# EAGLE design integrated_adc (EAGLE 9.6.2)

## Sheet 1 of 4: MCU + Periphery Ethernet Implementation Power, clock, bypassing, etc. for MCU, as well as CAN bus.
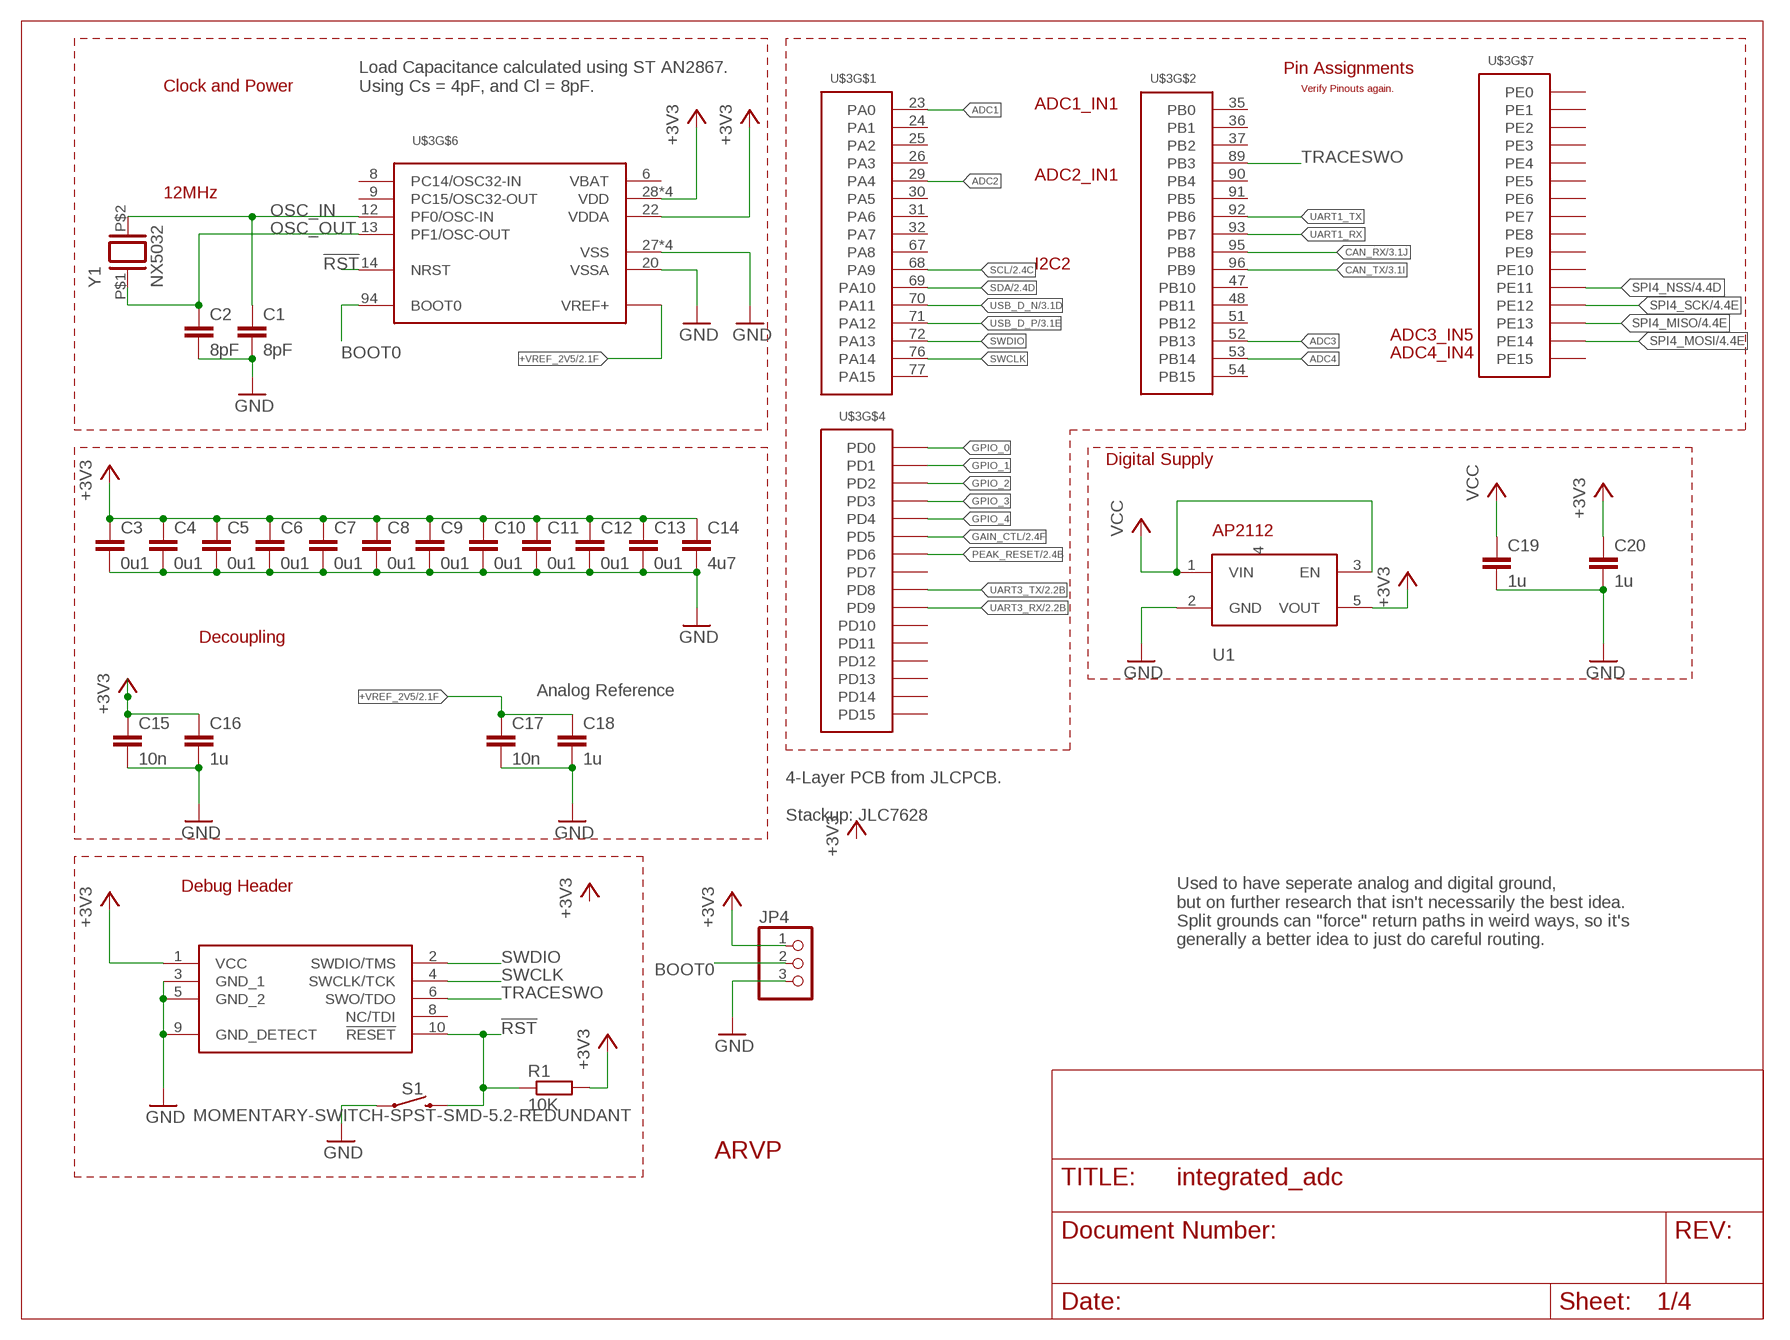
[diagram p0: schematic, sheet 1]

### Parts
ARVP1  ARVP_LOGO  [ARVP]
C1  8pF  C-EUC0805  [C0805]
C2  8pF  C-EUC0805  [C0805]
C3  0u1  C-EUC0805  [C0805]
C4  0u1  C-EUC0805  [C0805]
C5  0u1  C-EUC0805  [C0805]
C6  0u1  C-EUC0805  [C0805]
C7  0u1  C-EUC0805  [C0805]
C8  0u1  C-EUC0805  [C0805]
C9  0u1  C-EUC0805  [C0805]
C10  0u1  C-EUC0805  [C0805]
C11  0u1  C-EUC0805  [C0805]
C12  0u1  C-EUC0805  [C0805]
C13  0u1  C-EUC0805  [C0805]
C14  4u7  C-EUC0805  [C0805]
C15  10n  C-EUC0805  [C0805]
C16  1u  C-EUC0805  [C0805]
C17  10n  C-EUC0805  [C0805]
C18  1u  C-EUC0805  [C0805]
C19  1u  C-EUC0805  [C0805]
C20  1u  C-EUC0805  [C0805]
JP1  CORTEX-M-DBG  [FTSH-105-01-F-DV-007]
JP4  PINHD-1X3  [1X03]
R1  10K  R-EU_R0805  [R0805]
S1  MOMENTARY-SWITCH-SPST-SMD-5.2-REDUNDANT  [TACTILE_SWITCH_SMD_5.2MM]
U1  AP2112K-3.3TRG1  [SOT25]
U$3  STM32F303VE  [LQFP100]
Y1  NX5032  [NX5032]

### Nets
!RST: JP1.10(!RESET) R1.1 S1.3 S1.4 U$3.14(NRST)
+3V3: C3.1 C4.1 C5.1 C6.1 C7.1 C8.1 C9.1 C10.1 C11.1 C12.1 C13.1 C14.1 C15.1 C16.1 C20.1 JP1.1(VCC) JP4.1 R1.2 U1.5(VOUT) U$3.22(VDDA) U$3.28(VDD) U$3.50(VDD) U$3.75(VDD) U$3.100(VDD) ; also sheet 2,3,4
+VREF_2V5: C17.1 C18.1 U$3.21(VREF+) ; also sheet 2
ADC1: U$3.23(PA0) ; also sheet 2
ADC2: U$3.29(PA4) ; also sheet 2
ADC3: U$3.52(PB13) ; also sheet 2
ADC4: U$3.53(PB14) ; also sheet 2
BOOT0: JP4.2 U$3.94(BOOT0)
CAN_RX: U$3.95(PB8) ; also sheet 3
CAN_TX: U$3.96(PB9) ; also sheet 3
GAIN_CTL: U$3.86(PD5) ; also sheet 2
GND: C1.2 C2.2 C3.2 C4.2 C5.2 C6.2 C7.2 C8.2 C9.2 C10.2 C11.2 C12.2 C13.2 C14.2 C15.2 C16.2 C17.2 C18.2 C19.2 C20.2 JP1.3(GND_1) JP1.5(GND_2) JP1.9(GND_DETECT) JP4.3 S1.1 S1.2 U1.2(GND) U$3.20(VSSA) U$3.27(VSS) U$3.49(VSS) U$3.74(VSS) U$3.99(VSS) ; also sheet 2,3,4
GPIO_0: U$3.81(PD0) ; also sheet 2
GPIO_1: U$3.82(PD1) ; also sheet 2
GPIO_2: U$3.83(PD2) ; also sheet 2
GPIO_3: U$3.84(PD3) ; also sheet 2
GPIO_4: U$3.85(PD4) ; also sheet 2
OSC_IN: C1.1 U$3.12(PF0/OSC-IN) Y1.P$2
OSC_OUT: C2.1 U$3.13(PF1/OSC-OUT) Y1.P$1
PEAK_RESET: U$3.87(PD6) ; also sheet 2
SCL: U$3.68(PA9) ; also sheet 2,3
SDA: U$3.69(PA10) ; also sheet 2,3
SPI4_MISO: U$3.44(PE13) ; also sheet 4
SPI4_MOSI: U$3.45(PE14) ; also sheet 4
SPI4_NSS: U$3.42(PE11) ; also sheet 4
SPI4_SCK: U$3.43(PE12) ; also sheet 4
SWCLK: JP1.4(SWCLK/TCK) U$3.76(PA14)
SWDIO: JP1.2(SWDIO/TMS) U$3.72(PA13)
TRACESWO: JP1.6(SWO/TDO) U$3.89(PB3)
UART1_RX: U$3.93(PB7)
UART1_TX: U$3.92(PB6)
UART3_RX: U$3.56(PD9) ; also sheet 2
UART3_TX: U$3.55(PD8) ; also sheet 2
USB_D_N: U$3.70(PA11) ; also sheet 3
USB_D_P: U$3.71(PA12) ; also sheet 3
VCC: C19.1 U1.1(VIN) U1.3(EN) ; also sheet 2,3
Unconnected: JP1.8(NC/TDI) U1.4(NC) U$3.1(PE2) U$3.2(PE3) U$3.3(PE4) U$3.4(PE5) U$3.5(PE6) U$3.6(VBAT) U$3.7(PC13) U$3.8(PC14/OSC32-IN) U$3.9(PC15/OSC32-OUT) U$3.10(PF9) U$3.11(PF10) U$3.15(PC0) U$3.16(PC1) U$3.17(PC2) U$3.18(PC3) U$3.19(PF2) U$3.24(PA1) U$3.25(PA2) U$3.26(PA3) U$3.30(PA5) U$3.31(PA6) U$3.32(PA7) U$3.33(PC4) U$3.34(PC5) U$3.35(PB0) U$3.36(PB1) U$3.37(PB2) U$3.38(PE7) U$3.39(PE8) U$3.40(PE9) U$3.41(PE10) U$3.46(PE15) U$3.47(PB10) U$3.48(PB11) U$3.51(PB12) U$3.54(PB15) U$3.57(PD10) U$3.58(PD11) U$3.59(PD12) U$3.60(PD13) U$3.61(PD14) U$3.62(PD15) U$3.63(PC6) U$3.64(PC7) U$3.65(PC8) U$3.66(PC9) U$3.67(PA8) U$3.73(PF6) U$3.77(PA15) U$3.78(PC10) U$3.79(PC11) U$3.80(PC12) U$3.88(PD7) U$3.90(PB4) U$3.91(PB5) U$3.97(PE0) U$3.98(PE1)

### Notes on the sheet
- Pin Assignments
- Clock and Power
- Load Capacitance calculated using ST AN2867.
  Using Cs = 4pF, and Cl = 8pF.
- Verify Pinouts again.
- ADC1_IN1
- ADC2_IN1
- 12MHz
- I2C2
- ADC3_IN5
- ADC4_IN4
- Digital Supply
- Decoupling
- Analog Reference
- 4-Layer PCB from JLCPCB.
  
  Stackup: JLC7628
- Debug Header
- Used to have seperate analog and digital ground,
  but on further research that isn't necessarily the best idea.
  Split grounds can "force" return paths in weird ways, so it's
  generally a better idea to just do careful routing.

## Sheet 2 of 4: Analog Measurement + Inputs Has the external ADC, as well as all the connections required for reading the hydrophone signals.
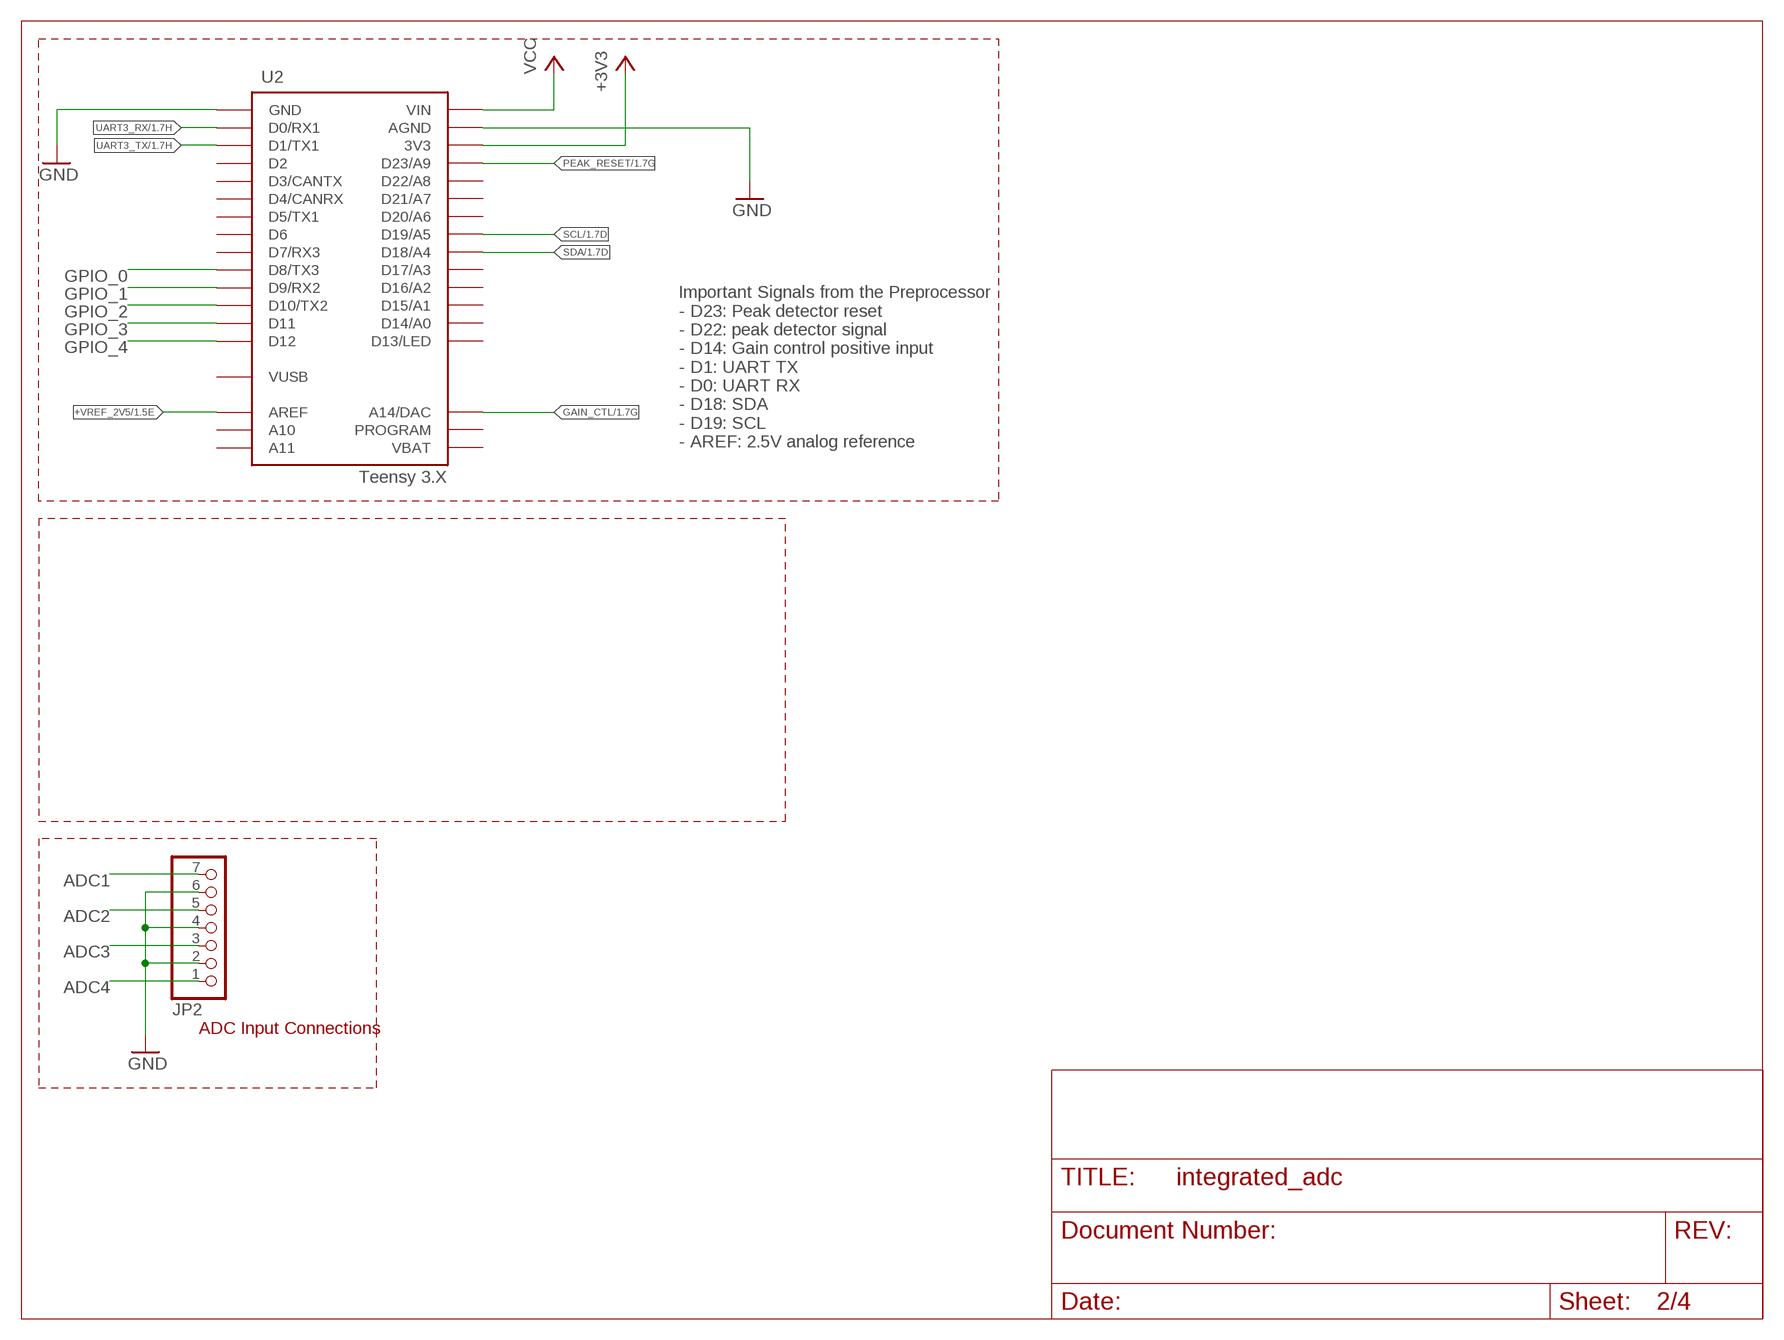
[diagram p1: schematic, sheet 2]

### Parts
JP2  PINHD-1X7/90  [1X07/90]
U2  TEENSY_3.X_PINOUT  [TEENSY_3.X_PINOUT]

### Nets
+3V3: U2.3V3 U2.3V3_2(3V3) ; also sheet 1,3,4
+VREF_2V5: U2.AREF ; also sheet 1
ADC1: JP2.7 ; also sheet 1
ADC2: JP2.5 ; also sheet 1
ADC3: JP2.3 ; also sheet 1
ADC4: JP2.1 ; also sheet 1
GAIN_CTL: U2.A14(A14/DAC) ; also sheet 1
GND: JP2.2 JP2.4 JP2.6 U2.AGND U2.GND_1(GND) U2.GND_2(GND) ; also sheet 1,3,4
GPIO_0: U2.D8(D8/TX3) ; also sheet 1
GPIO_1: U2.D9(D9/RX2) ; also sheet 1
GPIO_2: U2.D10(D10/TX2) ; also sheet 1
GPIO_3: U2.D11 ; also sheet 1
GPIO_4: U2.D12 ; also sheet 1
PEAK_RESET: U2.D23(D23/A9) ; also sheet 1
SCL: U2.D19(D19/A5) ; also sheet 1,3
SDA: U2.D18(D18/A4) ; also sheet 1,3
UART3_RX: U2.D0(D0/RX1) ; also sheet 1
UART3_TX: U2.D1(D1/TX1) ; also sheet 1
VCC: U2.VIN ; also sheet 1,3
Unconnected: U2.A10 U2.A11 U2.D2 U2.D3(D3/CANTX) U2.D4(D4/CANRX) U2.D5(D5/TX1) U2.D6 U2.D7(D7/RX3) U2.D13(D13/LED) U2.D14(D14/A0) U2.D15(D15/A1) U2.D16(D16/A2) U2.D17(D17/A3) U2.D20(D20/A6) U2.D21(D21/A7) U2.D22(D22/A8) U2.PROGRAM U2.VBAT

### Notes on the sheet
- Important Signals from the Preprocessor
  - D23: Peak detector reset
  - D22: peak detector signal
  - D14: Gain control positive input
  - D1: UART TX
  - D0: UART RX
  - D18: SDA
  - D19: SCL
  - AREF: 2.5V analog reference
- ADC Input Connections

## Sheet 3 of 4: Communications
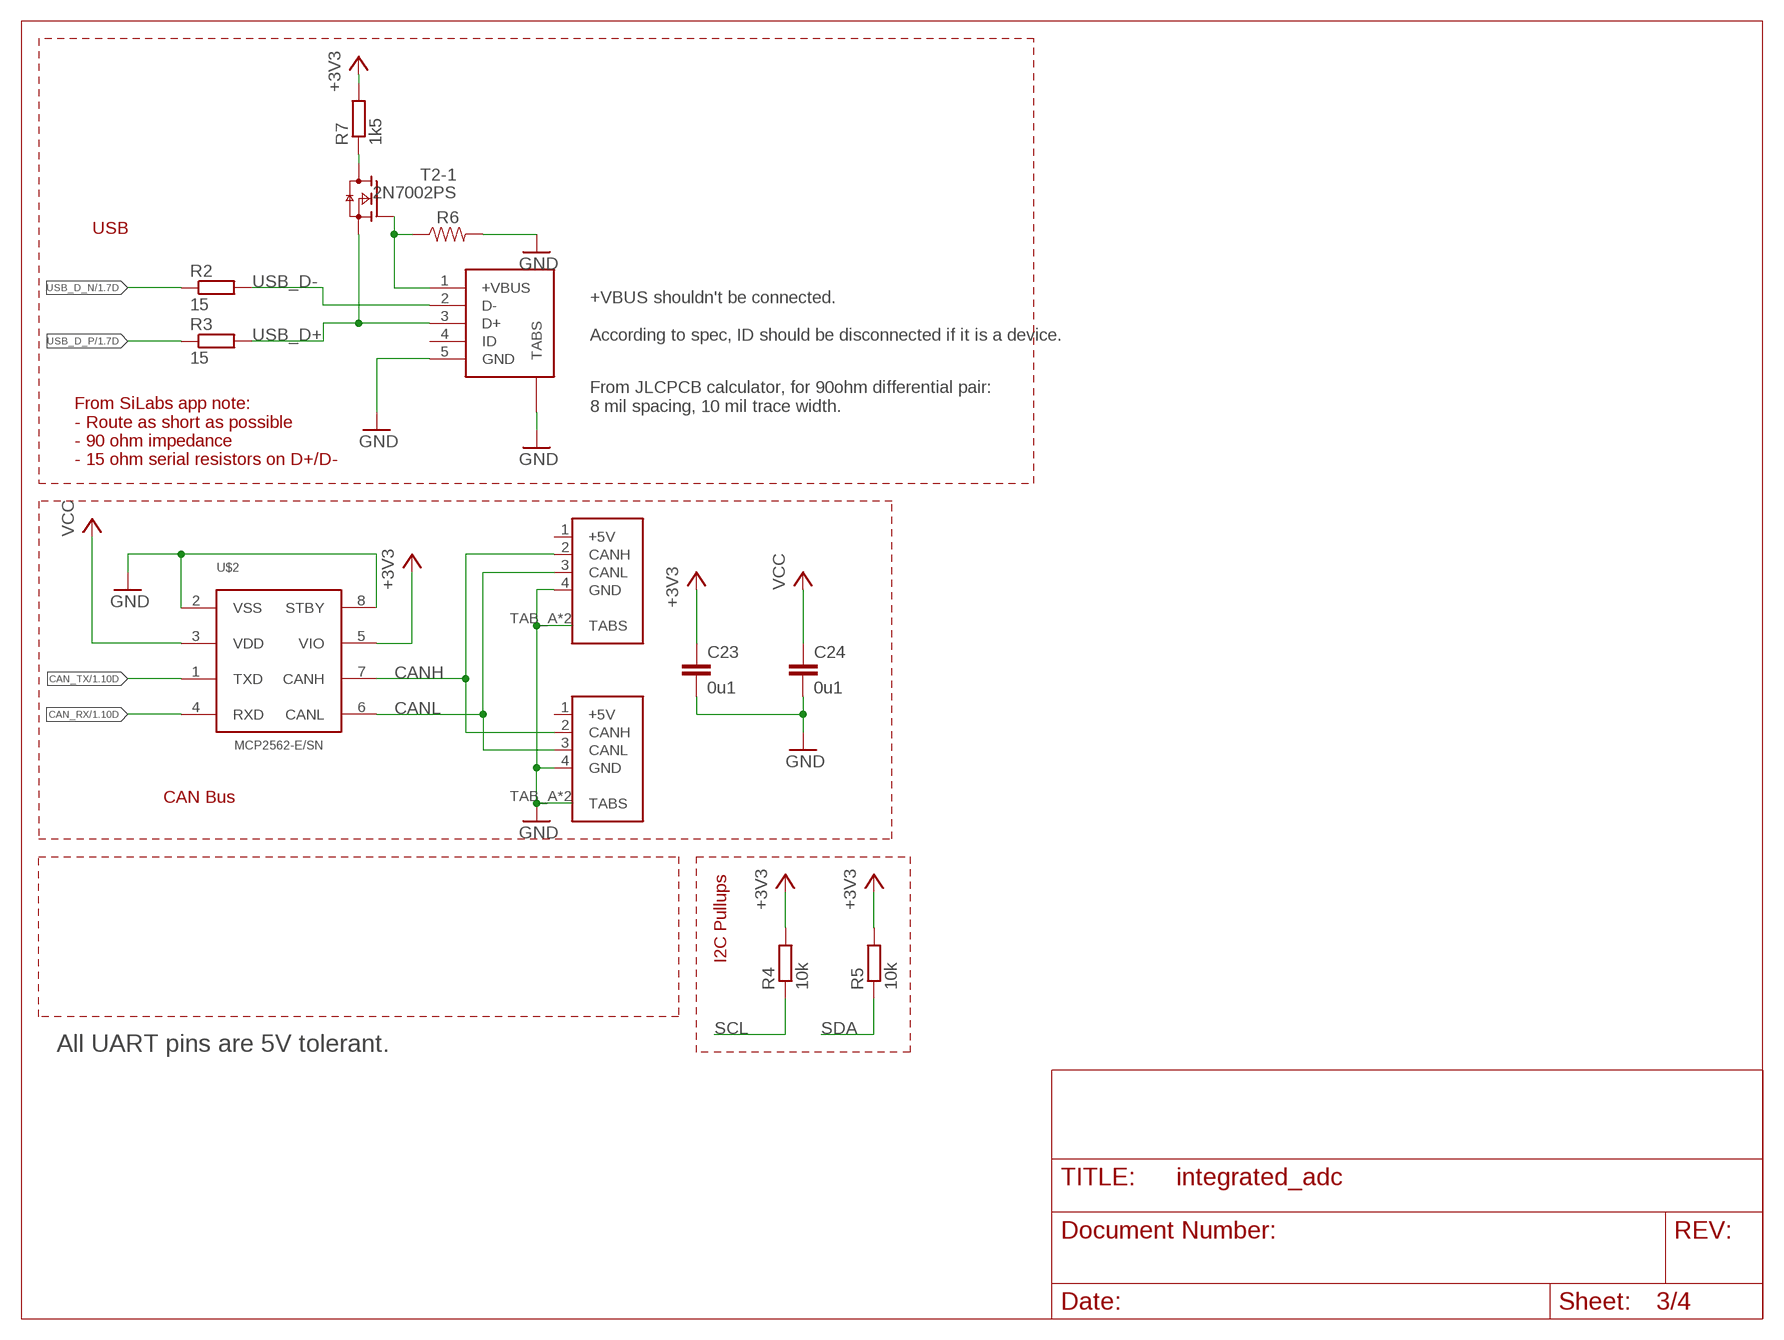
[diagram p2: schematic, sheet 3]

### Parts
C23  0u1  C-EUC0805  [C0805]
C24  0u1  C-EUC0805  [C0805]
CON1  UAVCAN_MICRO  [SM04B-GHS-TB]
CON2  UAVCAN_MICRO  [SM04B-GHS-TB]
R2  15  R-EU_R0805  [R0805]
R3  15  R-EU_R0805  [R0805]
R4  10k  R-EU_R0805  [R0805]
R5  10k  R-EU_R0805  [R0805]
R6  RESISTOR1206  [1206]
R7  1k5  R-EU_R0805  [R0805]
T2  2N7002PS  [SOT363]
U$2  MCP2562-E/SN  [SOIC8]
U$4  AMPHENOL_MICROB-USB  [AMPHENOL_MICROB_SMD]

### Nets
+3V3: C23.1 R4.2 R5.2 R7.2 U$2.5(VIO) ; also sheet 1,2,4
CAN_RX: U$2.4(RXD) ; also sheet 1
CAN_TX: U$2.1(TXD) ; also sheet 1
CANH: CON1.2(CANH) CON2.2(CANH) U$2.7(CANH)
CANL: CON1.3(CANL) CON2.3(CANL) U$2.6(CANL)
GND: C23.2 C24.2 CON1.4(GND) CON1.TAB_A(TABS) CON1.TAB_B(TABS) CON2.4(GND) CON2.TAB_A(TABS) CON2.TAB_B(TABS) R6.2 U$2.2(VSS) U$2.8(STBY) U$4.5(GND) U$4.TAB1(TABS) U$4.TAB2(TABS) U$4.TAB3(TABS) U$4.TAB4(TABS) ; also sheet 1,2,4
N$1: R6.1 T2.2(-1:G) U$4.1(+VBUS)
N$4: R7.1 T2.6(-1:D)
SCL: R4.1 ; also sheet 1,2
SDA: R5.1 ; also sheet 1,2
USB_D+: R3.2 T2.1(-1:S) U$4.3(D+)
USB_D-: R2.2 U$4.2(D-)
USB_D_N: R2.1 ; also sheet 1
USB_D_P: R3.1 ; also sheet 1
VCC: C24.1 U$2.3(VDD) ; also sheet 1,2
Unconnected: CON1.1(+5V) CON2.1(+5V) T2.3(-2:D) T2.4(-2:S) T2.5(-2:G) U$4.4(ID)

### Notes on the sheet
- USB
- +VBUS shouldn't be connected.
  
  According to spec, ID should be disconnected if it is a device.
- From JLCPCB calculator, for 90ohm differential pair:
  8 mil spacing, 10 mil trace width.
- From SiLabs app note:
  - Route as short as possible
  - 90 ohm impedance
  - 15 ohm serial resistors on D+/D-
- CAN Bus
- I2C Pullups
- All UART pins are 5V tolerant.

## Sheet 4 of 4: Ethernet Implementation
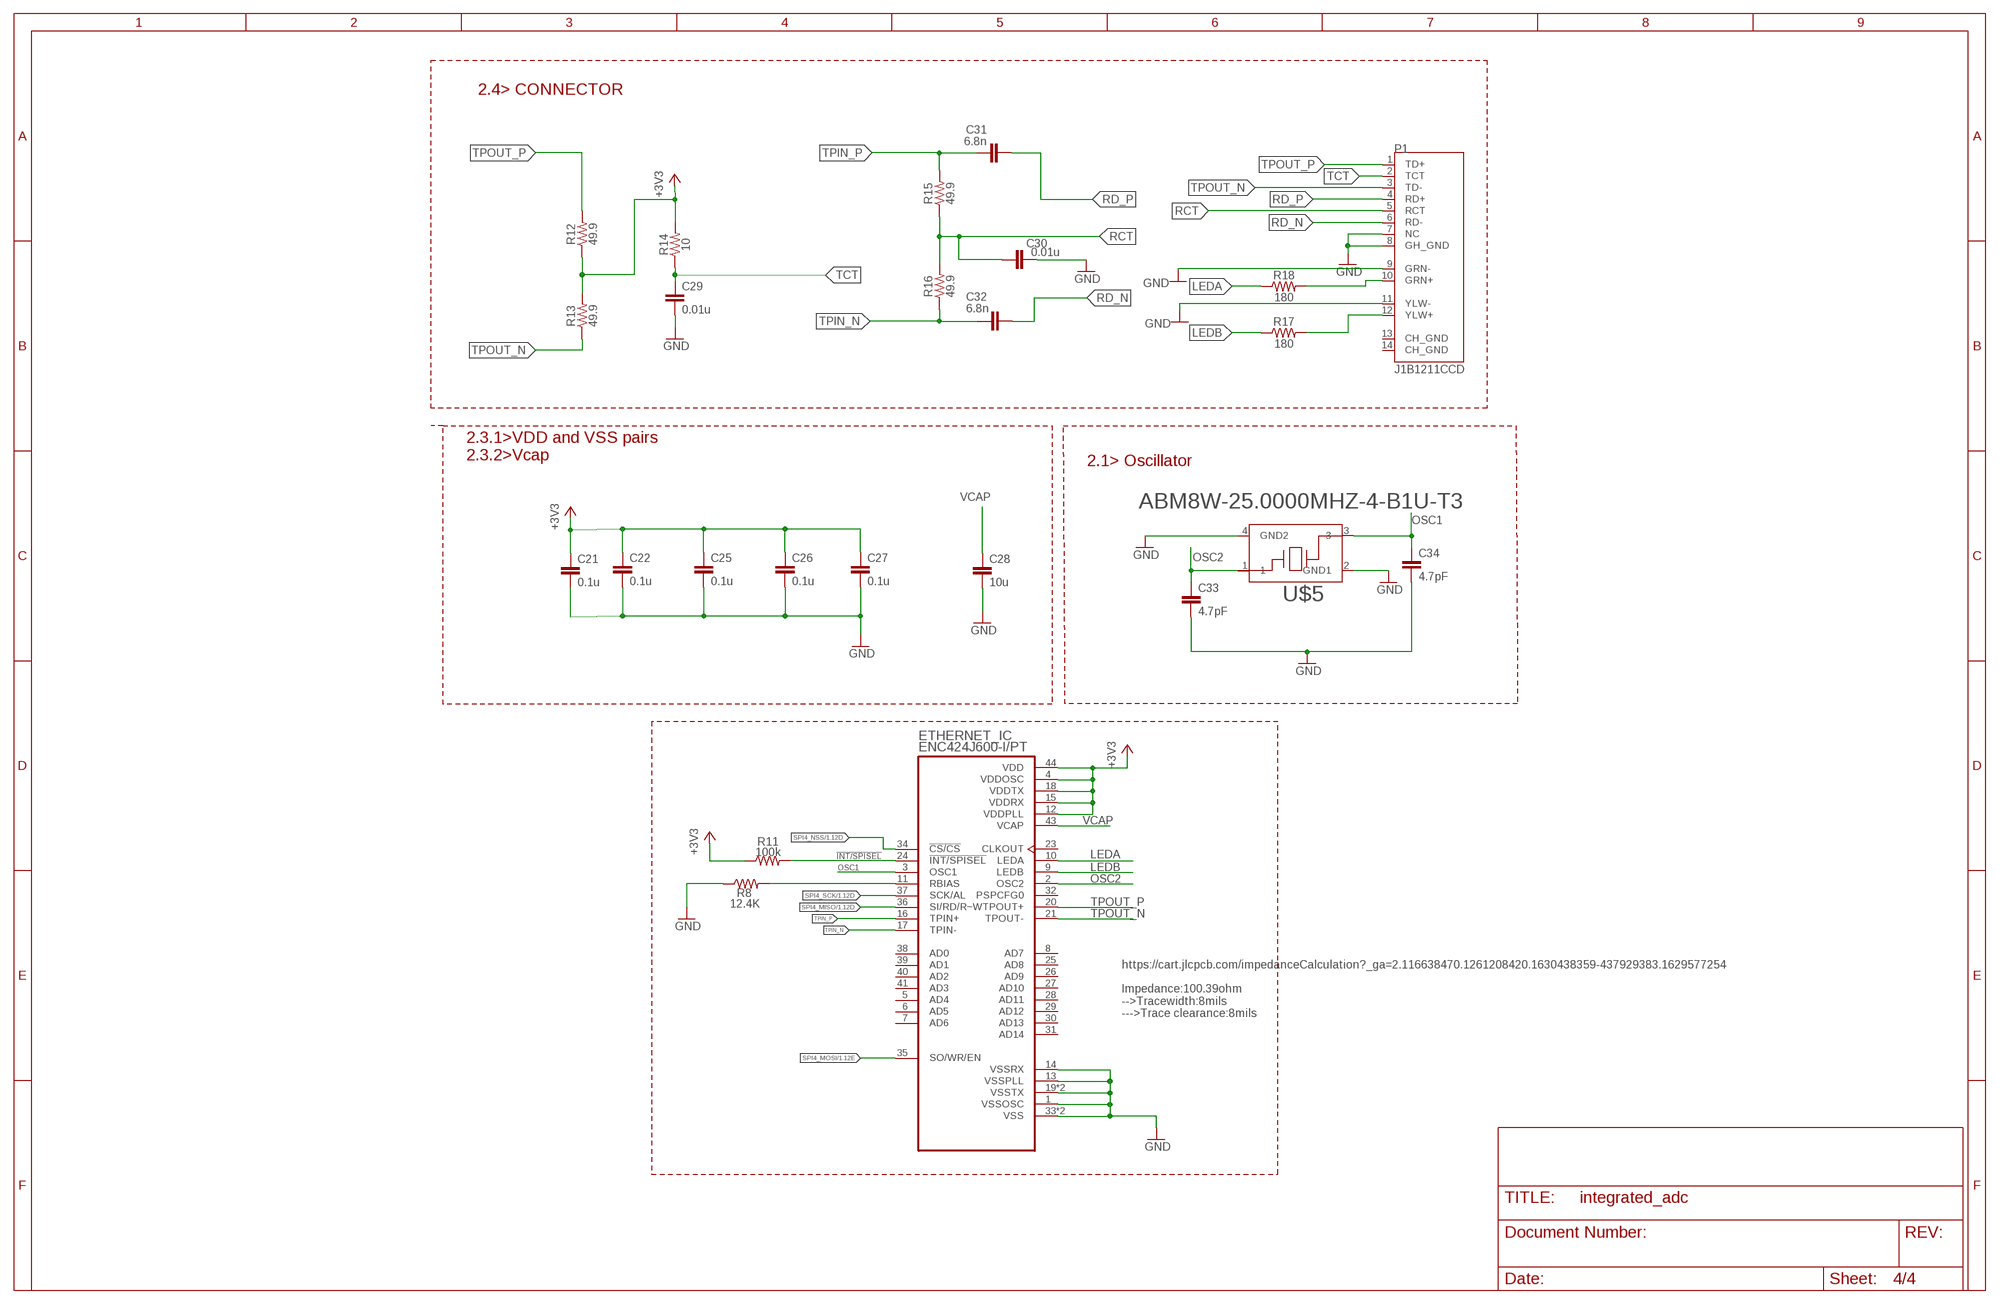
[diagram p3: schematic, sheet 4]

### Parts
C21  0.1u  C-EUC0402  [C0402]
C22  0.1u  C-EUC0402  [C0402]
C25  0.1u  C-EUC0402  [C0402]
C26  0.1u  C-EUC0402  [C0402]
C27  0.1u  C-EUC0402  [C0402]
C28  10u  C-EUC0402  [C0402]
C29  0.01u  C-EUC0402  [C0402]
C30  0.01u  C-EUC0402  [C0402]
C31  6.8n  C-EUC0402  [C0402]
C32  6.8n  C-EUC0402  [C0402]
C33  4.7pF  C-EUC0402  [C0402]
C34  4.7pF  C-EUC0402  [C0402]
ETHERNET_IC  ENC424J600-I/PT  [QFP80P1200X1200X120-44N]
P1  J1B1211CCD  [J1B1211CCD]
R8  12.4K  1.8MOHM  [0603]
R11  100k  100KOHM-0603-1/10W-1%  [0603]
R12  49.9  715OHM-0603-1/10W-1%  [0603]
R13  49.9  715OHM-0603-1/10W-1%  [0603]
R14  10  715OHM-0603-1/10W-1%  [0603]
R15  49.9  715OHM-0603-1/10W-1%  [0603]
R16  49.9  715OHM-0603-1/10W-1%  [0603]
R17  180  AC0603FR-0712K4L  [RESC1608X55N]
R18  180  AC0603FR-0712K4L  [RESC1608X55N]
U$5  ABM8W-25.0000MHZ-4-B1U-T3  [XTAL_ABM8W-25.0000MHZ-4-B1U-T3]

### Nets
!INT/SPISEL!: ETHERNET_IC.24(!INT/SPISEL) R11.2
+3V3: C21.1 C22.1 C25.1 C26.1 C27.1 ETHERNET_IC.4(VDDOSC) ETHERNET_IC.12(VDDPLL) ETHERNET_IC.15(VDDRX) ETHERNET_IC.18(VDDTX) ETHERNET_IC.44(VDD) R11.1 R12.1 R13.2 R14.2 ; also sheet 1,2,3
GND: C21.2 C22.2 C25.2 C26.2 C27.2 C28.2 C29.2 C30.2 C33.2 C34.2 ETHERNET_IC.1(VSSOSC) ETHERNET_IC.13(VSSPLL) ETHERNET_IC.14(VSSRX) ETHERNET_IC.19(VSSTX) ETHERNET_IC.22(VSSTX) ETHERNET_IC.33(VSS) ETHERNET_IC.42(VSS) P1.7(NC) P1.8(GH_GND) P1.9(GRN-) P1.11(YLW-) R8.1 U$5.2(GND1) U$5.4(GND2) ; also sheet 1,2,3
LEDA: ETHERNET_IC.10(LEDA) R18.1
LEDB: ETHERNET_IC.9(LEDB) R17.1
N$2: P1.10(GRN+) R18.2
N$3: P1.12(YLW+) R17.2
OSC1: C34.1 ETHERNET_IC.3(OSC1) U$5.3
OSC2: C33.1 ETHERNET_IC.2(OSC2) U$5.1
RBIAS: ETHERNET_IC.11(RBIAS) R8.2
RCT: C30.1 P1.5(RCT) R15.1 R16.2
RD_N: C32.1 P1.6(RD-)
RD_P: C31.2 P1.4(RD+)
SPI4_MISO: ETHERNET_IC.36(SI/RD/R~W) ; also sheet 1
SPI4_MOSI: ETHERNET_IC.35(SO/WR/EN) ; also sheet 1
SPI4_NSS: ETHERNET_IC.34(!CS/CS) ; also sheet 1
SPI4_SCK: ETHERNET_IC.37(SCK/AL) ; also sheet 1
TCT: C29.1 P1.2(TCT) R14.1
TPIN_N [ethernet_ic_diff]: C32.2 ETHERNET_IC.17(TPIN-) R16.1
TPIN_P [ethernet_ic_diff]: C31.1 ETHERNET_IC.16(TPIN+) R15.2
TPOUT_N [ethernet_ic_diff]: ETHERNET_IC.21(TPOUT-) P1.3(TD-) R13.1
TPOUT_P [ethernet_ic_diff]: ETHERNET_IC.20(TPOUT+) P1.1(TD+) R12.2
VCAP: C28.1 ETHERNET_IC.43(VCAP)
Unconnected: ETHERNET_IC.5(AD4) ETHERNET_IC.6(AD5) ETHERNET_IC.7(AD6) ETHERNET_IC.8(AD7) ETHERNET_IC.23(CLKOUT) ETHERNET_IC.25(AD8) ETHERNET_IC.26(AD9) ETHERNET_IC.27(AD10) ETHERNET_IC.28(AD11) ETHERNET_IC.29(AD12) ETHERNET_IC.30(AD13) ETHERNET_IC.31(AD14) ETHERNET_IC.32(PSPCFG0) ETHERNET_IC.38(AD0) ETHERNET_IC.39(AD1) ETHERNET_IC.40(AD2) ETHERNET_IC.41(AD3) P1.13(CH_GND) P1.14(CH_GND)

### Notes on the sheet
- 2.4> CONNECTOR
- 2.3.1>VDD and VSS pairs
  2.3.2>Vcap
- 2.1> Oscillator
- https://cart.jlcpcb.com/impedanceCalculation?_ga=2.116638470.1261208420.1630438359-437929383.1629577254
  
  Impedance:100.39ohm
  -->Tracewidth:8mils
  --->Trace clearance:8mils

## Power pins joined to a net without a drawn wire
VUSB: U2.VUSB

## Library data of the parts
ARVP1 = ARVP:ARVP_LOGO
C1-C20 C23 C24 = resistor:C-EU: CAPACITOR, European symbol
C21 C22 C25-C32 = ENC424J600_ethernet_circuits (1):C-EU: CAPACITOR, European symbol; SPICEPREFIX: C
C33 C34 = rcl:C-EU: CAPACITOR, European symbol; SPICEPREFIX: C
CON1 CON2 = integrated_adc:UAVCAN_MICRO: CAN Bus Standard Connector
ETHERNET_IC = ENC424J600_ethernet_circuits (1):ENC424J600-I/PT: IC ETHERNET CTRLR W/SPI 44-TQFP// Ethernet Controller 10/100 Base-T PHY SPI, Parallel Interface 44-TQFP (10x10)// Datasheet link: http://ww1.microchip.com/downloads/en/DeviceDoc/39935c.pdf; AVAILABILITY: In Stock; DESCRIPTION: Ethernet Controller 10/100 Base-T PHY SPI, Parallel Interface 44-TQFP (10x10); MF: Microchip; MP: ENC424J600-I/PT; PACKAGE: TQFP-44 Microchip; PRICE: None
JP1 = integrated_adc:CORTEX-M-DBG: Cortex-M Debug Header Standard debug/programming header used for programming Cortex parts. Does not include shroud but does have key pin removed.
JP2 = pinhead:PINHD-1X7: PIN HEADER
JP4 = pinhead:PINHD-1X3: PIN HEADER
P1 = J1B1211CCD:J1B1211CCD: J1B1211CCD SINGLE RJ45 CONNECTOR MODULE WITH 10/100 BASE-TX MAGNETICS AND LEDS. -Suitable for CAT 5 & 6 Fast Ethernet Cable or better UTP. -Meets or exceeds IEEE 802.3 standard for 100 Base-T. -350 µH minimum OCL with 8 mA bias current. -Minimum 1500 Vrms isolation per IEEE 802.3 requirement. -All materials are RoHS and UL94-V0 compliant. -RoHS peak solder rating 260°C. -Meet EN60950-1 basic insulation requirement. -Recommended panel. Check prices <https://pricing.snapeda.com/parts/J1B1211CCD/Ceetus/view-part?ref=eda>; AVAILABILITY: In Stock; DESCRIPTION: 1 Port RJ45 Magjack Connector Through Hole 10/100 Base-T, AutoMDIX; MF: Ceetus; MP: J1B1211CCD; PACKAGE: None; PRICE: None; PURCHASE-URL: https://pricing.snapeda.com/search/part/J1B1211CCD/?ref=eda
R1-R5 R7 = resistor:R-EU_: RESISTOR, European symbol
R6 = SparkFun-Resistors:RESISTOR: Generic Resistor Package
R8 = SparkFun-Resistors:1.8MOHM: 1.8 MOhms ±5% 0.1W, 1/10W Chip Resistor 0603; PROD_ID: RES-13994; VALUE: 1.8M
R11 = ENC424J600_ethernet_circuits (1):100KOHM: 100kΩ resistor A resistor is a passive two-terminal electrical component that implements electrical resistance as a circuit element. Resistors act to reduce current flow, and, at the same time, act to lower voltage levels within circuits. - Wikipedia; PROD_ID: RES-07828
R12-R16 = SparkFun-Resistors:715OHM: 715Ω resistor A resistor is a passive two-terminal electrical component that implements electrical resistance as a circuit element. Resistors act to reduce current flow, and, at the same time, act to lower voltage levels within circuits. - Wikipedia; PROD_ID: RES-07850; VALUE: 715
R17 R18 = ENC424J600_ethernet_circuits (1):AC0603FR-0712K4L: RES SMD 12.4K OHM 1% 1/10W 0603; DESCRIPTION: 12.4 kOhms ±1% 0.1W, 1/10W Chip Resistor 0603 (1608 Metric) Automotive AEC-Q200, Moisture Resistant Thick Film; DIGI-KEY_PART_NUMBER: 13-AC0603FR-0712K4LCT-ND; MF: Yageo; MP: AC0603FR-0712K4L; PACKAGE: 1608 Yageo
S1 = SparkFun-Switches:MOMENTARY-SWITCH-SPST: Momentary Switch (Pushbutton) - SPST Normally-open (NO) SPST momentary switches (buttons, pushbuttons). Variants PTH-12MM - 12mm square, through-hole Momentary Pushbutton Switch - 12mm Square <https://www.sparkfun.com/products/9190> (COM-09190) PTH-6.0MM, PTH-6.0MM-KIT - 6.0mm square, through-hole Mini Pushbutton Switch <https://www.sparkfun.com/products/97> (COM-00097) KIT package intended for soldering kit's - only one side of pads' copper is exposed. PTH-RIGHT-ANGLE-KIT - Right-angle, through-hole Right Angle Tactile Button <https://www.sparkfun.com/products/10791> - Used on SparkFun BigTime Watch Kit <https://www.sparkfun.com/products/11734> SMD-12MM - 12mm square, surface-mount Tactile Button - SMD (12mm) <https://www.sparkfun.com/products/12993> (COM-12993) Used on SparkFun PicoBoard <https://www.sparkfun.com/products/11888> SMD-4.5MM - 4.5mm Square Trackball Switch Used on SparkFun Blackberry Trackballer Breakout <https://www.sparkfun.com/products/13169> SMD-4.6MMX2.8MM - 4.60mm x 2.80mm, surface mount Used on SparkFun SAMD21 Mini Breakout <https://www.sparkfun.com/products/13664> SMD-5.2MM, SMD-5.2-REDUNDANT - 5.2mm square, surface-mount Mini Pushbutton Switch - SMD <https://www.sparkfun.com/products/8720> (COM-08720) Used on Arduino Pro Mini <https://www.sparkfun.com/products/11114> REDUNDANT package connects both switch circuits together SMD-6.0X3.5MM - 6.0 x 3.5mm, surface mount Momentary Reset Switch SMD <https://www.sparkfun.com/products/8229> (COM-08229) SMD-6.2MM-TALL - 6.2mm square, surface mount Tactile Button - SMD (6mm) <https://www.sparkfun.com/products/12992> Used on SparkFun Digital Sandbox <https://www.sparkfun.com/products/12651> SMD-RIGHT-ANGLE - Right-angle, surface mount Used on SparkFun Block for Intel® Edison - Arduino <https://www.sparkfun.com/products/13036>; PROD_ID: SWCH-08247; SF_SKU: COM-08720
T2 = nxp_60:2N7002P: 60 V, 320 mA N-channel Trench MOSFET Dual N-channel enhancement mode Field-Effect Transistor (FET) in a very small SOT363 (SC-88) Surface-Mounted Device (SMD) plastic package using Trench MOSFET technology. AAL Eindhoven MK
U1 = integrated_adc:AP2112K-3.3TRG1
U2 = integrated_adc:TEENSY_3.X_PINOUT: Teensy 3.X Footprint Designed to accept a teensy 3.0, 3.1, or 3.2. It can also serve as headers/pinout to replace a teensy.
U$2 = integrated_adc:MCP2562-E/SN: CAN Bus Transciever
U$3 = integrated_adc:STM32F303VE
U$4 = integrated_adc:AMPHENOL_MICROB-USB: Micro USB Receptacle DigiKey Page <https://www.digikey.ca/product-detail/en/amphenol-icc-fci/10118194-0001LF/609-4618-1-ND/2785382>
U$5 = ENC424J600_ethernet_circuits (1):ABM8W-25.0000MHZ-4-B1U-T3: CRYSTAL 25.0000MHZ 4PF SMD
Y1 = integrated_adc:NX5032

## Net classes
1 usb_diff: width 0.254 mm
2 ethernet_ic_diff: width 0.203 mm, clearance 0.203 mm

## Board
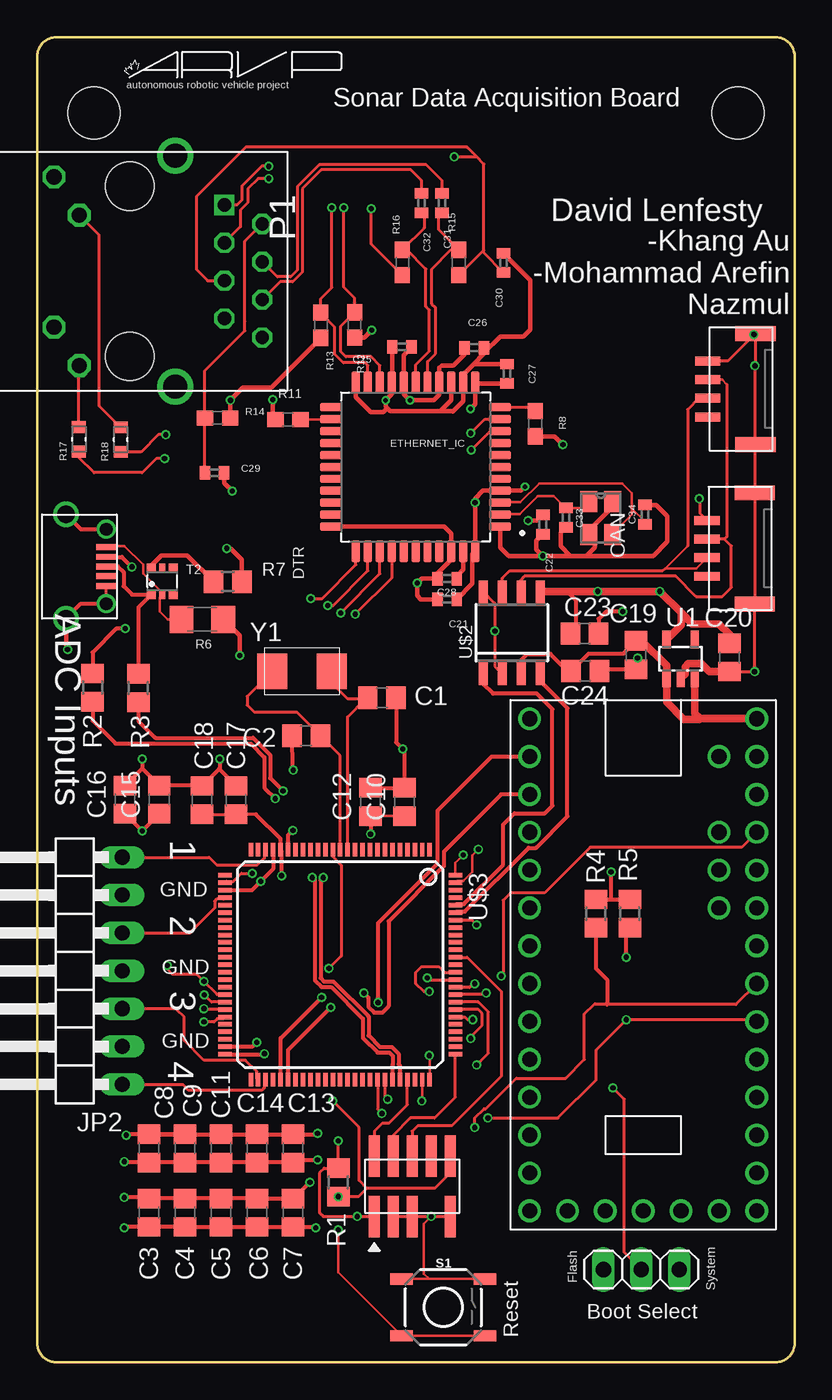
[diagram p4: board, top side]
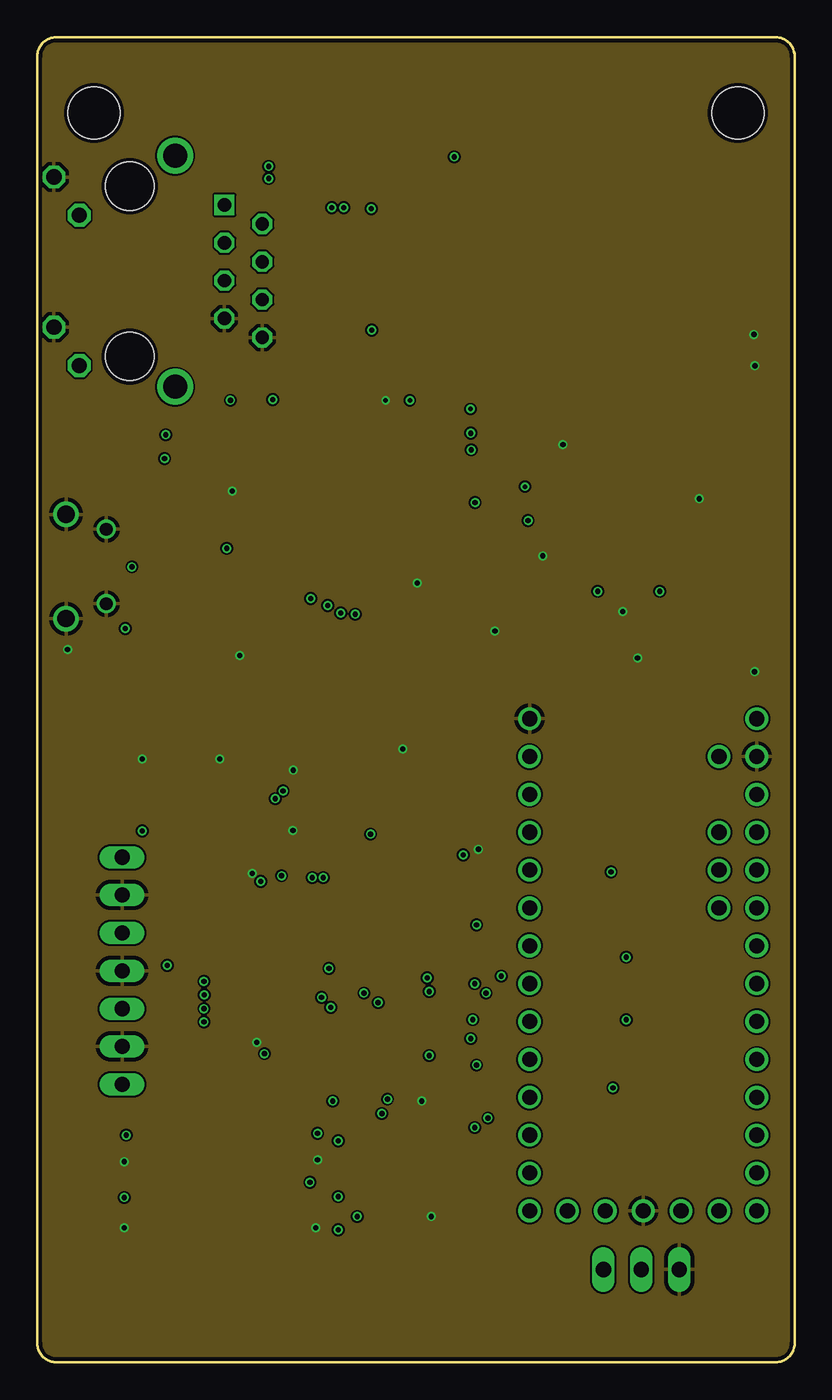
[diagram p5: board, inner layer Route2]
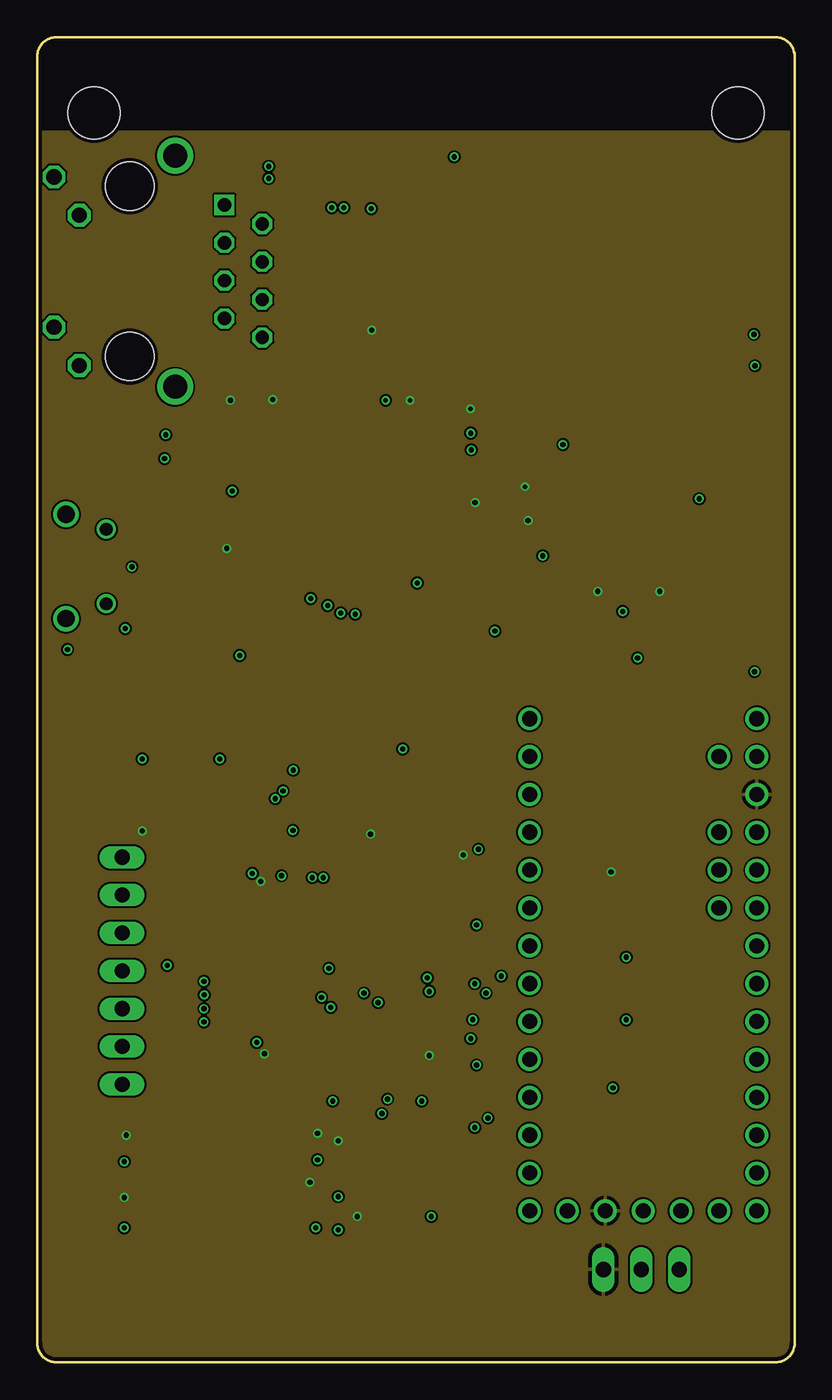
[diagram p6: board, inner layer Route15]
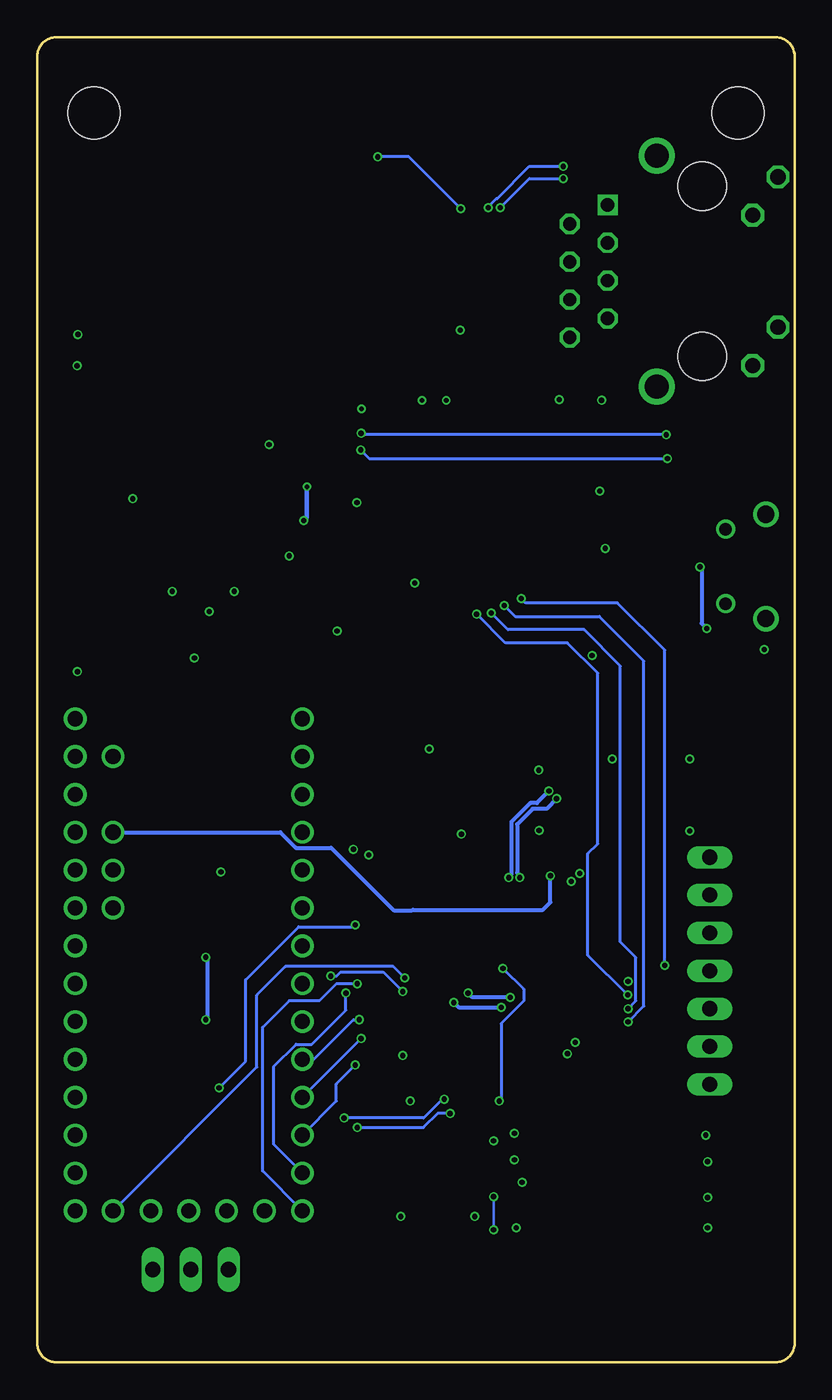
[diagram p7: board, bottom side, seen from below]

Size 50.8 x 88.9 mm. Coordinates in mm from the lower left corner, seen from the top.
Outline: 0,1.27 0,87.63 arc-90 1.27,88.9 49.53,88.9 arc-90 50.8,87.63 50.8,1.27 arc-90 49.53,0 1.27,0 arc-90 0,1.27
Copper layers (1*2*15*16): Top 0.035mm / dielectric 0.1702mm / Route2 0.0175mm / dielectric 47mil / Route15 0.0175mm / dielectric 0.1702mm / Bottom 0.035mm
Design rules "OSHPark4Layer": minimum track width 6mil, minimum drill 10mil, track to track 5mil, track to pad 5mil, pad to pad 5mil, via to via 5mil, smd to smd 0mil, copper to edge 10mil, drill to drill 10mil, minimum pad ring 5mil, minimum via ring 5mil, stop-mask expansion 2mil, vias tented up to drill 100mil, thermal gap 10mil
Holes 3.5 mm at 46.99,83.82 3.81,83.82

### Footprints (pad centres in the part's own frame; a part is rotated, then mirrored left to right if it is on the bottom)
C0805 = smd 1.3 x 1.5: 1 -0.95,0; 2 0.95,0
C0402 = smd 0.7 x 0.9: 1 -0.65,0; 2 0.65,0
SM04B-GHS-TB = smd 0.6 x 1.7: 1 -1.875,0.85; 2 -0.625,0.85; 3 0.625,0.85; 4 1.875,0.85 | smd 1 x 2.7: TAB_A -3.725,-2.35; TAB_B 3.725,-2.35
QFP80P1200X1200X120-44N = smd 1.47 x 0.55: 1 -5.67,4; 2 -5.67,3.2; 3 -5.67,2.4; 4 -5.67,1.6; 5 -5.67,0.8; 6 -5.67,0; 7 -5.67,-0.8; 8 -5.67,-1.6; 9 -5.67,-2.4; 10 -5.67,-3.2; 11 -5.67,-4; 23 5.67,-4; 24 5.67,-3.2; 25 5.67,-2.4; 26 5.67,-1.6; 27 5.67,-0.8; 28 5.67,0; 29 5.67,0.8; 30 5.67,1.6; 31 5.67,2.4; 32 5.67,3.2; 33 5.67,4 | smd 0.55 x 1.47: 12 -4,-5.67; 13 -3.2,-5.67; 14 -2.4,-5.67; 15 -1.6,-5.67; 16 -0.8,-5.67; 17 0,-5.67; 18 0.8,-5.67; 19 1.6,-5.67; 20 2.4,-5.67; 21 3.2,-5.67; 22 4,-5.67; 34 4,5.67; 35 3.2,5.67; 36 2.4,5.67; 37 1.6,5.67; 38 0.8,5.67; 39 0,5.67; 40 -0.8,5.67; 41 -1.6,5.67; 42 -2.4,5.67; 43 -3.2,5.67; 44 -4,5.67
FTSH-105-01-F-DV-007 = smd 0.737 x 2.794: 1 -2.54,-2.032; 2 -2.54,2.032; 3 -1.27,-2.032; 4 -1.27,2.032; 5 0,-2.032; 6 0,2.032; 8 1.27,2.032; 9 2.54,-2.032; 10 2.54,2.032
1X07/90 = drill 1.016 long: 1 -7.62,-3.81; 2 -5.08,-3.81; 3 -2.54,-3.81; 4 0,-3.81; 5 2.54,-3.81; 6 5.08,-3.81; 7 7.62,-3.81
1X03 = drill 1.016 long: 1 -2.54,0; 2 0,0; 3 2.54,0
J1B1211CCD = drill 0.9 square: 1 -4.445,6.35 | drill 0.9 octagon: 2 -3.175,8.89; 3 -1.905,6.35; 4 -0.635,8.89; 5 0.635,6.35; 6 1.905,8.89; 7 3.175,6.35; 8 4.445,8.89 | drill 1.02 octagon: 9 -6.325,-5.08; 10 -3.758,-3.38; 11 3.758,-5.08; 12 6.325,-3.38 | drill 1.6: 13 -7.75,3.05; 14 7.75,3.05 | hole 3.25: -5.715,0; 5.715,0
R0805 = smd 1.3 x 1.5: 1 -0.95,0; 2 0.95,0
1206 = smd 1.6 x 1.8: 1 -1.4,0; 2 1.4,0
0603 = smd 1.1 x 1: 1 -0.85,0; 2 0.85,0
RESC1608X55N = smd 0.79 x 0.93: 1 -0.82,0; 2 0.82,0
TACTILE_SWITCH_SMD_5.2MM = smd 1.524 x 0.762: 1 -2.794,1.905; 2 2.794,1.905; 3 -2.794,-1.905; 4 2.794,-1.905
SOT363 = smd 0.6 x 0.6: 1 -0.75,-0.9; 3 0.75,-0.9; 4 0.75,0.9; 6 -0.75,0.9 | smd 0.4 x 0.6: 2 0,-0.9; 5 0,0.9
SOT25 = smd 0.55 x 1.2: 1 -0.95,-1.3; 2 0,-1.3; 3 0.95,-1.3; 4 0.95,1.3; 5 -0.95,1.3
TEENSY_3.X_PINOUT = drill 1.016: 3V3 0,-5.08; 3V3_2 -10.16,-33.02; A10 -2.54,-10.16; A11 -2.54,-12.7; A14 -2.54,-33.02; AGND 0,-2.54; AREF -2.54,-7.62; D0 -15.24,-2.54; D1 -15.24,-5.08; D2 -15.24,-7.62; D3 -15.24,-10.16; D4 -15.24,-12.7; D5 -15.24,-15.24; D6 -15.24,-17.78; D7 -15.24,-20.32; D8 -15.24,-22.86; D9 -15.24,-25.4; D10 -15.24,-27.94; D11 -15.24,-30.48; D12 -15.24,-33.02; D13 0,-33.02; D14 0,-30.48; D15 0,-27.94; D16 0,-25.4; D17 0,-22.86; D18 0,-20.32; D19 0,-17.78; D20 0,-15.24; D21 0,-12.7; D22 0,-10.16; D23 0,-7.62; GND_1 -15.24,0; GND_2 -7.62,-33.02; PROGRAM -5.08,-33.02; VBAT -12.7,-33.02; VIN 0,0; VUSB -2.54,-2.54
SOIC8 = smd 0.6 x 1.5: 1 -1.905,-2.75; 2 -0.635,-2.75; 3 0.635,-2.75; 4 1.905,-2.75; 5 1.905,2.75; 6 0.635,2.75; 7 -0.635,2.75; 8 -1.905,2.75
LQFP100 = smd 0.9 x 0.3: 1 -7.72,6; 2 -7.72,5.5; 3 -7.72,5; 4 -7.72,4.5; 5 -7.72,4; 6 -7.72,3.5; 7 -7.72,3; 8 -7.72,2.5; 9 -7.72,2; 10 -7.72,1.5; 11 -7.72,1; 12 -7.72,0.5; 13 -7.72,0; 14 -7.72,-0.5; 15 -7.72,-1; 16 -7.72,-1.5; 17 -7.72,-2; 18 -7.72,-2.5; 19 -7.72,-3; 20 -7.72,-3.5; 21 -7.72,-4; 22 -7.72,-4.5; 23 -7.72,-5; 24 -7.72,-5.5; 25 -7.72,-6; 51 7.72,-6; 52 7.72,-5.5; 53 7.72,-5; 54 7.72,-4.5; 55 7.72,-4; 56 7.72,-3.5; 57 7.72,-3; 58 7.72,-2.5; 59 7.72,-2; 60 7.72,-1.5; 61 7.72,-1; 62 7.72,-0.5; 63 7.72,0; 64 7.72,0.5; 65 7.72,1; 66 7.72,1.5; 67 7.72,2; 68 7.72,2.5; 69 7.72,3; 70 7.72,3.5; 71 7.72,4; 72 7.72,4.5; 73 7.72,5; 74 7.72,5.5; 75 7.72,6 | smd 0.3 x 0.9: 26 -6,-7.72; 27 -5.5,-7.72; 28 -5,-7.72; 29 -4.5,-7.72; 30 -4,-7.72; 31 -3.5,-7.72; 32 -3,-7.72; 33 -2.5,-7.72; 34 -2,-7.72; 35 -1.5,-7.72; 36 -1,-7.72; 37 -0.5,-7.72; 38 0,-7.72; 39 0.5,-7.72; 40 1,-7.72; 41 1.5,-7.72; 42 2,-7.72; 43 2.5,-7.72; 44 3,-7.72; 45 3.5,-7.72; 46 4,-7.72; 47 4.5,-7.72; 48 5,-7.72; 49 5.5,-7.72; 50 6,-7.72; 76 6,7.72; 77 5.5,7.72; 78 5,7.72; 79 4.5,7.72; 80 4,7.72; 81 3.5,7.72; 82 3,7.72; 83 2.5,7.72; 84 2,7.72; 85 1.5,7.72; 86 1,7.72; 87 0.5,7.72; 88 0,7.72; 89 -0.5,7.72; 90 -1,7.72; 91 -1.5,7.72; 92 -2,7.72; 93 -2.5,7.72; 94 -3,7.72; 95 -3.5,7.72; 96 -4,7.72; 97 -4.5,7.72; 98 -5,7.72; 99 -5.5,7.72; 100 -6,7.72
AMPHENOL_MICROB_SMD = smd 0.4 x 1.35: 1 -1.3,2.7; 2 -0.65,2.7; 3 0,2.7; 4 0.65,2.7; 5 1.3,2.7 | drill 0.85 pad 1.25: TAB1 -2.5,2.7; TAB2 2.5,2.7 | drill 1.15 pad 1.55: TAB3 -3.5,0; TAB4 3.5,0
XTAL_ABM8W-25.0000MHZ-4-B1U-T3 = smd 1.397 x 1.143: 1 -1.1,-0.8; 2 1.1,-0.8; 3 1.1,0.8; 4 -1.1,0.8
NX5032 = smd 2 x 2.4: P$1 -2,0; P$2 2,0

### Placement (x,y rotation side)
ARVP1  5.97,85.47 0 top
C1  23.11,44.58 0 top
C2  18.03,42.04 180 top
C3  7.49,10.03 270 top
C4  9.91,10.03 270 top
C5  12.32,10.03 270 top
C6  14.73,10.03 270 top
C7  17.14,10.03 270 top
C8  7.49,14.35 270 top
C9  9.91,14.35 270 top
C10  24.64,37.59 90 top
C11  12.32,14.35 270 top
C12  22.35,37.59 90 top
C13  17.14,14.35 270 top
C14  14.73,14.35 270 top
C15  8.18,37.74 90 top
C16  5.89,37.74 90 top
C17  13.34,37.72 90 top
C18  11.05,37.72 90 top
C19  40.16,47.45 270 top
C20  46.43,47.29 270 top
C21  27.48,51.18 180 top
C22  33.91,56.21 270 top
C23  36.7,48.9 0 top
C24  36.75,46.38 0 top
C25  24.46,68.12 180 top
C26  29.31,68.07 0 top
C27  31.5,66.32 90 top
C28  27.48,52.58 180 top
C29  11.89,59.66 0 top
C30  31.27,73.76 90 top
C31  27.15,77.77 90 top
C32  25.78,77.77 270 top
C33  35.46,56.67 270 top
C34  40.77,56.87 90 top
CON1  45.82,65.3 90 top
CON2  45.77,54.61 90 top
ETHERNET_IC  25.37,60.07 180 top
JP1  25.15,11.81 0 top
JP2  1.88,26.26 90 top
JP4  40.51,6.22 0 top
P1  6.2,73.2 270 top
R1  20.19,12.06 90 top
R2  3.71,45.26 90 top
R3  6.78,45.24 90 top
R4  37.47,30.1 90 top
R5  39.75,30.1 90 top
R6  11.07,49.83 0 top
R7  12.78,52.37 0 top
R8  33.4,62.97 90 top
R11  16.81,63.25 0 top
R12  21.29,69.6 90 top
R13  19.02,69.57 270 top
R14  12.09,63.35 0 top
R15  28.27,73.79 90 top
R16  24.49,73.79 270 top
R17  2.79,61.93 90 top
R18  5.59,61.9 90 top
S1  27.23,3.68 0 top
T2  8.38,52.4 0 top
U1  43.15,47.19 0 top
U2  48.26,43.18 0 top
U$2  31.83,48.95 0 top
U$3  20.32,26.67 270 top
U$4  1.93,53.39 270 top
U$5  37.8,56.64 270 top
Y1  17.75,46.35 0 top

### Tracks (layer width: path | path; a pad name or v marks a point on that pad's centre or on a via)
!INT/SPISEL!
  Top 0.152: R11.2 19.18,63.25 19.2,63.27
  Top 0.254: 19.2,63.27 ETHERNET_IC.24
!RST  (via drill 0.35)
  Top 0.152: S1.4 S1.3 20.19,6.02 v20.19,8.89
  Top 0.203: U$3.14 19.82,33.93 20.4,33.35 20.4,27.26 v19.56,26.42 | JP1.10 27.69,12.7 26.67,11.68 22.1,11.68 | 22.1,11.68 21.53,11.12 R1.1 | 22.1,11.68 21.59,12.19 21.59,15.75 v19.81,17.53
  Bottom 0.152: v20.19,8.89 R1.1
  Bottom 0.203: v19.56,26.42 18.19,25.04 18.19,24.23 19.68,22.73 19.68,17.65 v19.81,17.53
  other vias: 20.19,11.12
+3V3  (via drill 0.3, 0.35)
  Top 0.152: U$3.75 26.32,20.54 v26.29,20.57 | U$3.100 28.04,33.5 v28.57,34.04 | C12.1 C10.1
  Top 0.203: JP1.1 v21.46,9.78 19.18,9.78 18.92,10.03 18.92,12.7 19.24,13.02 R1.2 v20.19,14.86 | 10.03,10.98 C4.1
  Top 0.254: C16.1 v7.04,35.65 C15.1 | U$3.22 15.82,33.09 v14.99,32.26 14.4,31.67 U$3.28 | U$3.50 15.21,20.67 v15.24,20.7 | 10.03,10.98 C5.1 C6.1 C7.1 17.21,10.98 v18.29,12.06 | C4.1 C3.1 7.43,11.05 v5.84,11.05 | C9.1 C11.1 C14.1 C13.1 18.73,15.3 v18.8,15.37 | C8.1 6.03,15.3 v5.97,15.24 | C12.1 v22.35,35.43 | R4.2 38.61,31.05 | 38.61,31.05 R5.2 | 38.61,31.05 38.48,31.18 v38.48,32.89 | 35.56,51.7 36.12,51.14 36.12,49.26 C23.1
  Top 0.305: C9.1 C8.1 | R7.2 13.73,53.86 12.98,54.61 v12.7,54.61 | C21.1 29.18,52.23 29.18,54.21 ETHERNET_IC.44 29.36,54.41 v29.36,57.68 29.36,57.96 29.87,58.47 ETHERNET_IC.4 32.44,58.47 v32.72,58.75 | C22.1 33.51,56.46 v32.92,56.46 | ETHERNET_IC.15 | ETHERNET_IC.15 26.98,64.92 26.59,64.54 v24.99,64.54 24.57,64.96 ETHERNET_IC.18 24.57,67.59 C25.1 | v29.06,63.96 29.38,64.27 ETHERNET_IC.12 29.45,65.67 C27.1 | ETHERNET_IC.15 26.98,66.73 27.13,66.88 27.91,66.88 28.66,67.62 C26.1 | R14.2 12.94,64.53 | 12.94,64.53 v12.95,64.54 | R13.2 15.68,65.38 13.77,65.38 12.94,64.55 12.94,64.53 | R12.1 21.93,68.75 v22.43,69.24 | R11.1 15.8,63.41 v15.8,64.59
  Top 0.508: U$2.5 35.56,51.7 37.57,51.7 v37.59,51.72 v41.75,51.72 43.18,50.29 | 43.18,50.29 43.94,49.53 45.72,49.53 46.43,48.82 C20.1 | U1.5 43.18,49.47 43.18,50.29
  Bottom 0.305: v32.92,56.46 32.72,56.67 v32.72,58.75
  pour Route15: -1.27,82.55 52.07,82.55 52.07,-1.27 -1.27,-1.27
+VREF_2V5  (via drill 0.35)
  Top 0.203: 14.67,36.77 C17.1 C18.1
  Top 0.254: v16.38,32.64 16.36,32.66 16.36,34.35 U$3.21 16.32,35.12 14.67,36.77
  Bottom 0.254: U2.AREF 34.49,35.56 33.45,34.52 31.09,34.52 26.9,30.33 25.64,30.33 25.61,30.35 16.89,30.35 16.38,30.86 v16.38,32.64
ADC1
  Top 0.203: U$3.23 15.22,34.29 15.22,33.84 14.73,33.34 12.06,33.34 11.52,33.88 JP2.7
ADC2
  Top 0.203: JP2.5 10.23,28.8 11.9,30.47 11.9,30.93 12.04,31.07 12.5,31.07 U$3.29
ADC3
  Top 0.203: U$3.52 14.72,19.05 14.72,19.5 13.96,20.27 11.17,20.27 9.84,21.59 9.84,23.18 9.3,23.72 JP2.3
ADC4
  Top 0.203: U$3.53 15.22,18.85 15.22,18.39 15.07,18.25 10.14,18.25 9.74,18.64 JP2.1
BOOT0  (via drill 0.35)
  Top 0.203: U$3.94 29.13,29.67 v29.46,29.34 | JP4.2 39.37,7.37 39.37,17.65 v38.61,18.41
  Bottom 0.203: v38.61,18.41 36.83,20.19 36.83,25.65 33.27,29.21 29.59,29.21 v29.46,29.34
CAN_RX
  Top 0.254: U$3.95 28.11,30.24 28.68,30.24 32.96,34.52 33.45,34.52 35.56,36.63 35.56,43.89 33.73,45.72 U$2.4
CAN_TX
  Top 0.254: U$3.96 28.11,30.74 28.61,30.74 31.24,33.38 31.24,36.07 32,36.83 34.04,36.83 34.54,37.34 34.54,43.81 33.5,44.86 30.58,44.86 29.92,45.52 U$2.1
CANH
  Top 0.152: 41.95,53.11 42.1,53.26 | 42.1,53.26 43.61,54.77 | 42.1,53.26 44.2,53.26 CON2.2
  Top 0.203: CON1.2 44.36,64.68 43.61,63.93 43.61,54.77 | U$2.7 31.19,52.6 31.7,53.11 41.95,53.11
CANL
  Top 0.152: CON1.3 45.93,65.93 46.25,65.61
  Top 0.203: 46.09,55.23 CON2.3 | 46.25,65.61 46.25,55.4 46.09,55.23 | 46.09,55.23 46.56,54.77 46.56,51.99 45.95,51.38 44.17,51.38 42.82,52.73 32.67,52.73 32.46,52.53 U$2.6
GAIN_CTL  (via drill 0.35)
  Top 0.203: v26.16,25.78 26.27,25.67 U$3.86
  Bottom 0.203: U2.A14 36.07,19.81 36.07,24.64 34.16,26.54 26.92,26.54 v26.16,25.78
GND  (via drill 0.3, 0.35)
  Top 0.152: U$3.74 25.82,17.57 v25.78,17.53 | v29.59,34.42 29.18,34.01 29.18,32.89 28.59,32.29 28.16,32.29 U$3.99 | S1.2 26.29,5.59 | 26.29,5.59 S1.1 | 26.29,5.59 25.93,5.94 25.93,9.3 v26.42,9.78
  Top 0.203: JP1.3 JP1.5 v26.42,9.78 JP1.9 | C8.2 7.62,13.4 9.65,13.4 C9.2 C11.2 | U$3.27 12.7,32.27 13.15,32.27 13.69,32.8 v14.42,32.8 | C19.2 40.16,47.14 v40.26,47.24 | U$4.TAB2 U$4.5 | U$2.8 30.66,50.95 30.66,50.85 30.7,50.82 v30.7,49.06 30.7,46.69 U$2.2 | v44.4,57.94 44.45,57.89 44.45,56.96 CON2.4 | C20.2 48.09,46.34 | v48.11,46.33 48.11,50.87 CON2.TAB_A CON2.TAB_B 48.12,61.53 CON1.TAB_A 48.17,66.81 | 48.17,66.81 v48.13,66.85 | CON1.4 46.32,67.18 CON1.TAB_B 48.17,66.81
  Top 0.254: C1.2 24.06,41.59 v24.51,41.15 24.64,41.02 C10.2 C12.2 | C2.2 17.09,39.8 v17.17,39.73 | v12.24,40.47 12.24,39.76 | 7.04,39.84 C15.2 11.02,38.69 C18.2 12.19,39.81 12.24,39.76 | v7.04,40.47 7.04,39.84 | 7.04,39.84 C16.2 | U$3.20 16.82,35.36 v17.14,35.69 | U$3.49 12.64,21.21 14.46,21.21 v14.72,21.47 | C17.2 12.24,39.76 | C8.2 5.9,13.4 v5.84,13.46 | v18.8,13.59 17.33,13.59 C13.2 C14.2 C11.2 9.65,13.4 | v5.84,9.02 5.91,9.08 C3.2 C4.2 C5.2 C6.2 C7.2 18.6,9.08 v18.67,9.02 | C9.2 7.62,13.4 | U$4.TAB3 2.93,55.89 U$4.TAB1 | U$4.TAB4 2.93,50.89 U$4.TAB2 | v39.27,50.37 38.15,50.37 37.65,49.87 C23.2 | C24.2 37.82,46.5 C19.2 | 48.09,46.34 v48.11,46.33
  Top 0.305: v13.59,47.42 13.57,47.44 13.57,48.74 R6.2 | 38.59,57.7 U$5.4 38.59,57.42 36.99,55.82 U$5.2 37.38,55.16 37.38,54.65 36.83,54.1 | C34.2 41.53,57.52 42.27,56.78 42.27,55.07 41.3,54.1 36.83,54.1 | U$4.TAB4 1.93,47.93 v2.03,47.83 | ETHERNET_IC.1 31.05,54.67 31.62,54.1 v33.91,54.1 | C21.2 25.73,51.18 25.48,51.44 v25.48,52.27 25.78,52.58 C28.2 26.83,52.92 27.6,53.68 27.77,53.86 ETHERNET_IC.42 27.77,55.59 27.29,56.07 ETHERNET_IC.33 | C33.2 35.1,55.66 35.1,54.76 35.76,54.1 | ETHERNET_IC.14 27.77,64.55 27.03,63.8 | 27.03,63.8 23.67,63.8 23.47,64.01 | 23.47,64.01 23.37,64.11 v23.37,64.54 23.77,64.95 ETHERNET_IC.19 23.81,65.78 C25.2 | 27.03,63.8 27.86,63.8 27.88,63.79 28.57,64.49 ETHERNET_IC.13 28.57,66.28 29.26,66.97 | ETHERNET_IC.22 21.38,64.76 22.38,63.75 23.22,63.75 23.47,64.01 | 29.26,66.97 C27.2 | C26.2 29.96,67.73 | 29.26,66.97 29.96,67.67 29.96,67.73 | C22.2 33.48,55.13 33.48,54.53 v33.91,54.1 | v33.91,54.1 35.76,54.1 | 35.76,54.1 36.83,54.1 | R8.1 34.71,62.12 v35.26,61.57 | C30.2 33.07,72.61 33.07,69.29 32.59,68.81 31.04,68.81 29.96,67.73 | C29.2 12.54,58.99 v13.08,58.45
  Top 0.508: U1.2 43.45,46.19 43.45,46.65 43.67,46.87 44.54,46.87 45.07,46.34 C20.2
  other vias: 48.07,68.96
  pour Route2: -1.27,89.81 52.07,89.81 52.07,-1.27 -1.27,-1.27
GPIO_0  (via drill 0.35)
  Top 0.203: v29.21,22.99 28.86,22.99 28.68,23.17 U$3.81
  Bottom 0.203: U2.D8 32.26,20.32 29.59,22.99 v29.21,22.99
GPIO_1  (via drill 0.35)
  Top 0.203: U$3.82 29.56,23.67 29.84,23.39 29.84,22.6 29.08,21.84 v29.08,21.72
  Bottom 0.203: U2.D9 v29.08,21.72
GPIO_2  (via drill 0.35)
  Top 0.203: v29.46,19.94 30.25,20.73 30.25,23.5 29.58,24.17 U$3.83
  Bottom 0.203: U2.D10 30.73,17.53 30.73,18.67 v29.46,19.94
GPIO_3  (via drill 0.35)
  Top 0.203: v30.1,24.77 30,24.67 U$3.84
  Bottom 0.203: U2.D11 34.92,14.61 34.92,19.85 33.44,21.34 32.38,21.34 30.1,23.62 v30.1,24.77
GPIO_4  (via drill 0.35)
  Top 0.203: U$3.85 28.07,25.14 28.98,25.14 29.24,25.4 v29.34,25.4
  Bottom 0.203: U2.D12 35.69,12.83 35.69,22.48 33.91,24.26 31.88,24.26 30.74,25.4 v29.34,25.4
LEDA  (via drill 0.35)
  Top 0.203: v29.08,62.33 30.02,63.27 ETHERNET_IC.10 | R18.1 6.96,61.08 8.11,62.23 v8.61,62.23
  Bottom 0.203: v29.08,62.33 28.98,62.23 v8.61,62.23
LEDB  (via drill 0.35)
  Top 0.203: ETHERNET_IC.9 30.36,62.47 v29.11,61.21 | v8.53,60.63 7.98,60.63 7.04,59.69 3.81,59.69 2.79,60.71 R17.1
  Bottom 0.203: v29.11,61.21 28.52,60.63 v8.53,60.63
N$1
  Top 0.152: U$4.1 4.71,54.77 5.84,54.77 7.1,53.51 7.1,52.92 8.38,51.64 T2.2 8.2,51.32 8.2,50.37 8.74,49.84 R6.1
N$2
  Top 0.203: R18.2 4.14,64.17 4.14,75.64 P1.10
N$3
  Top 0.203: R17.2 2.79,66.85 P1.12
N$4
  Top 0.152: T2.6 7.65,53.31
  Top 0.305: R7.1 10.07,54.13 8.31,54.13 7.65,53.46 7.65,53.31
OSC1
  Top 0.152: C34.1 40.77,56.4 39.88,57.29 | 39.88,57.29 39.88,58.32 39.24,58.95 33.66,58.95 32.41,57.71 31.08,57.71 ETHERNET_IC.3 | U$5.3 38.59,55.59 39.88,56.88 39.88,57.29
OSC2
  Top 0.152: ETHERNET_IC.2 31.09,56.92 32.36,56.92 33.57,58.13 34.65,58.13 C33.1 36.57,57.32 U$5.1
OSC_IN
  Top 0.203: U$3.12 20.82,43.3 22.05,44.53 | C1.1 22.1,44.58 22.05,44.53 | Y1.P$2 19.75,45.57 20.8,44.53 22.05,44.53
OSC_OUT
  Top 0.203: U$3.13 20.32,40.7 C2.1 17.41,43.61 14.55,43.61 14.07,44.09 14.07,44.67 Y1.P$1
PEAK_RESET  (via drill 0.35)
  Top 0.203: v31.12,25.91 31.24,26.04 31.24,30.99 31.75,31.5 34.04,31.5 37.08,34.54 47.24,34.54 U2.D23 | v26.29,24.87 25.93,24.87 25.4,25.4 25.4,26.16 25.78,26.54 26.92,26.54 27.3,26.16 U$3.87
  Bottom 0.203: v31.12,25.91 30.73,25.91 30.45,26.19 27.6,26.19 v26.29,24.87
RBIAS
  Top 0.203: ETHERNET_IC.11 33.15,64.07 R8.2
RCT  (via drill 0.35)
  Top 0.203: 29.95,74.61 29.95,80.39 29.46,80.87 | 29.46,80.87 28.83,81.51 13.97,81.51 10.67,78.21 10.67,73.33 11.43,72.57 P1.5 | C30.1 29.95,74.43 29.95,74.61 | R16.2 22.4,75.02 v22.4,77.39 | v27.96,80.87 29.46,80.87 | R15.1 29.95,74.61
  Bottom 0.203: v22.4,77.39 25.88,80.87 v27.96,80.87
RD_N
  Top 0.203: C32.1 25.78,79.28 25.05,80.01 19.05,80.01 17.78,78.74 17.78,73.14 17.13,72.49 16.28,72.49 P1.6
RD_P
  Top 0.203: C31.2 27.15,79.28 26.09,80.34 18.91,80.34 17.45,78.88 17.45,73.28 16.99,72.82 16.1,72.82 P1.4
SCL  (via drill 0.35)
  Top 0.203: U$3.68 22.82,16.98 v23.11,16.69 | U2.D19 46.86,24 38.23,24 | v29.34,15.75 29.34,16.39 29.96,17.02 30.1,17.02 32.13,19.05 35.43,19.05 36.7,20.32 36.7,23.37 37.4,24.06 38.1,24.06 38.23,24.06
  Top 0.254: R4.1 37.47,26.42 38.23,25.65 38.23,24 38.23,24.06
  Bottom 0.203: v23.11,16.69 23.96,16.69 24.9,15.75 v29.34,15.75
SDA  (via drill 0.35)
  Top 0.203: U$3.69 23.32,17.83 v23.5,17.65 | U2.D18 48.13,22.99 39.51,22.99 v39.5,22.98 37.47,20.94 37.47,18.92 34.92,16.38 v30.23,16.38
  Top 0.254: v39.5,27.18 39.5,28.89 R5.1
  Bottom 0.203: v23.5,17.65 23.62,17.65 24.89,16.38 v30.23,16.38
  Bottom 0.254: v39.5,22.98 39.37,23.11 39.37,27.05 v39.5,27.18
SPI4_MISO  (via drill 0.35)
  Top 0.203: U$3.44 11.23,23.67 v11.18,23.72 | v20.34,50.27 22.98,52.9 ETHERNET_IC.36
  Bottom 0.203: v11.18,23.72 10.64,24.26 10.64,27.15 11.68,28.19 11.68,46.71 14.12,49.15 19.23,49.15 v20.34,50.27
SPI4_MOSI  (via drill 0.35)
  Top 0.203: U$3.45 12.48,23.05 12.05,23.05 11.84,22.84 v11.18,22.84 | ETHERNET_IC.35 22.18,53.11 19.84,50.77 v19.48,50.77
  Bottom 0.203: v11.18,22.84 10.11,23.9 10.11,47.04 13.11,50.04 18.75,50.04 v19.48,50.77
SPI4_NSS  (via drill 0.35)
  Top 0.203: U$3.42 12.06,24.67 v11.18,25.55 10.69,26.04 9.07,26.04 8.71,26.39 v8.71,26.62 | ETHERNET_IC.34 21.38,53.51 19.1,51.23 v18.34,51.23
  Bottom 0.203: v8.71,26.62 8.71,47.78 11.89,50.95 18.06,50.95 v18.34,51.23
SPI4_SCK  (via drill 0.35)
  Top 0.203: U$3.43 11.67,24.17 v11.2,24.64 | ETHERNET_IC.37 23.77,52.62 v21.34,50.19
  Bottom 0.203: v11.2,24.64 13.87,27.3 13.87,34.13 13.21,34.79 13.21,46.23 15.24,48.26 19.41,48.26 v21.34,50.19
SWCLK
  Top 0.203: U$3.76 28.04,17.78 26.64,16.38 25.02,16.38 23.88,15.24 JP1.4
SWDIO
  Top 0.203: U$3.72 24.82,17.27 23.61,16.06 23.17,16.06 22.61,15.49 JP1.2
TCT
  Top 0.203: C29.1 R14.1 11.24,66.54 13.92,69.22 13.92,69.85 13.92,75.21 P1.2
TPIN_N
  Top 0.203: ETHERNET_IC.17 25.38,66.92 26.31,67.85 26.31,70.59 26.06,70.84 26.06,73.36 24.78,74.64 R16.1 25.94,76.11 25.94,76.96 C32.2
TPIN_P
  Top 0.203: ETHERNET_IC.16 26.18,67.14 26.71,67.68 26.71,70.76 26.47,71.01 26.47,73.36 27.75,74.64 R15.2 26.9,76.02 26.9,76.88 C31.1
TPOUT_N  (via drill 0.35)
  Top 0.203: ETHERNET_IC.21 22.18,66.88 22,67.06 20.53,67.06 19.94,67.65 19.94,69.46 19.02,70.37 R13.1 19.02,71.38 19.75,72.1 v19.75,77.47 | v15.52,79.43 14.81,79.43 14.12,78.74 14.12,77.81 13.62,77.31 13.62,76.18 P1.3
  Bottom 0.203: v15.52,79.43 17.8,79.43 v19.75,77.47
TPOUT_P  (via drill 0.35)
  Top 0.203: ETHERNET_IC.20 22.98,66.88 22.39,67.46 20.7,67.46 20.34,67.82 20.34,69.51 R12.2 21.29,71.4 20.56,72.13 v20.56,77.47 | v15.52,80.23 15.04,80.23 13.72,78.91 13.72,77.98 13.39,77.65 P1.1
  Bottom 0.203: v20.56,77.47 20.36,77.67 20.36,77.72 20,78.08 19.95,78.08 17.8,80.23 v15.52,80.23
TRACESWO
  Top 0.203: U$3.89 28.83,27.18 31.11,24.89 31.11,19.18 27.81,15.88 25.53,15.88 25.15,15.49 JP1.6
UART3_RX  (via drill 0.35)
  Top 0.254: U$3.56 16.82,20.95 v19.68,23.81 | v22.86,24.13 22.86,29.46 26.86,33.47 26.86,37.02 30.48,40.64 U2.D0
  Bottom 0.254: v22.86,24.13 22.54,23.81 v19.68,23.81
UART3_TX  (via drill 0.35)
  Top 0.254: U$3.55 16.32,21.73 v19.07,24.48 | v21.91,24.77 22.2,24.47 22.2,23.86 22.59,23.47 23.16,23.47 23.56,23.88 23.56,29.59 27.27,33.3 27.27,34.25 31.11,38.1 U2.D1
  Bottom 0.254: v19.07,24.48 21.62,24.48 v21.91,24.77
USB_D+
  Top 0.254: U$4.3 5.41,53.39 5.79,53.01 5.79,52.07 6.36,51.5 T2.1 6.78,50.65 R3.2
USB_D-  (via drill 0.35)
  Top 0.254: R2.2 3.71,47.62 5.31,49.23 v5.89,49.23 | U$4.2 5.67,54.04 v6.35,53.37
  Bottom 0.254: v6.35,53.37 6.25,53.26 6.25,49.58 v5.89,49.23
USB_D_N  (via drill 0.35)
  Top 0.254: R2.1 3.71,43.05 5.26,41.5 14.33,41.5 15.24,40.59 15.24,38.54 v15.97,37.81 | v18.44,32.51 18.61,32.34 18.61,25.62 19.07,25.17 19.71,25.17 21.84,23.04 21.84,21.76 22.83,20.78 23.62,20.78 23.85,20.55 23.85,19.99 23.82,19.96 U$3.70
  Bottom 0.254: v15.97,37.81 16.64,37.13 17.58,37.13 18.61,36.1 18.61,32.85 18.44,32.67 v18.44,32.51
USB_D_P  (via drill 0.35)
  Top 0.254: R3.1 6.78,43.03 7.93,41.88 14.48,41.88 15.62,40.75 15.62,39.19 v16.48,38.33 | v19.17,32.51 19,32.34 19,25.78 19.23,25.55 19.87,25.55 22.23,23.2 22.23,21.92 22.99,21.16 23.78,21.16 24.23,20.71 24.23,19.99 24.32,19.9 U$3.71
  Bottom 0.254: v16.48,38.33 17.3,37.52 17.73,37.52 19,36.25 19,32.76 19.17,32.58 v19.17,32.51
VCAP
  Top 0.305: C28.1 28.13,52.73 28.57,53.17 ETHERNET_IC.43
VCC
  Top 0.254: U$2.3 32.46,47.12 32.87,47.52 34.41,47.52 35.68,46.25 C24.1 36.97,47.55 39.31,47.55 C19.1
  Top 0.508: C19.1 40.55,48.4 42.2,46.75 U1.1 42.2,44.28 43.36,43.13 44.4,43.13 44.45,43.18 | 44.45,43.18 U2.VIN | U1.3 44.1,43.53 44.45,43.18

### Text on the board
tPlace: Sonar Data Acquisition Board | David Lenfesty | -Khang Au / -Mohammad Arefin / Nazmul | CAN | DTR | ADC Inputs | 1 | GND | 2 | GND | 3 | GND | 4 | Flash | System | Boot Select | Reset